# EAGLE design WZ8048C070-V1.1-20230407 (EAGLE 9.5.1)
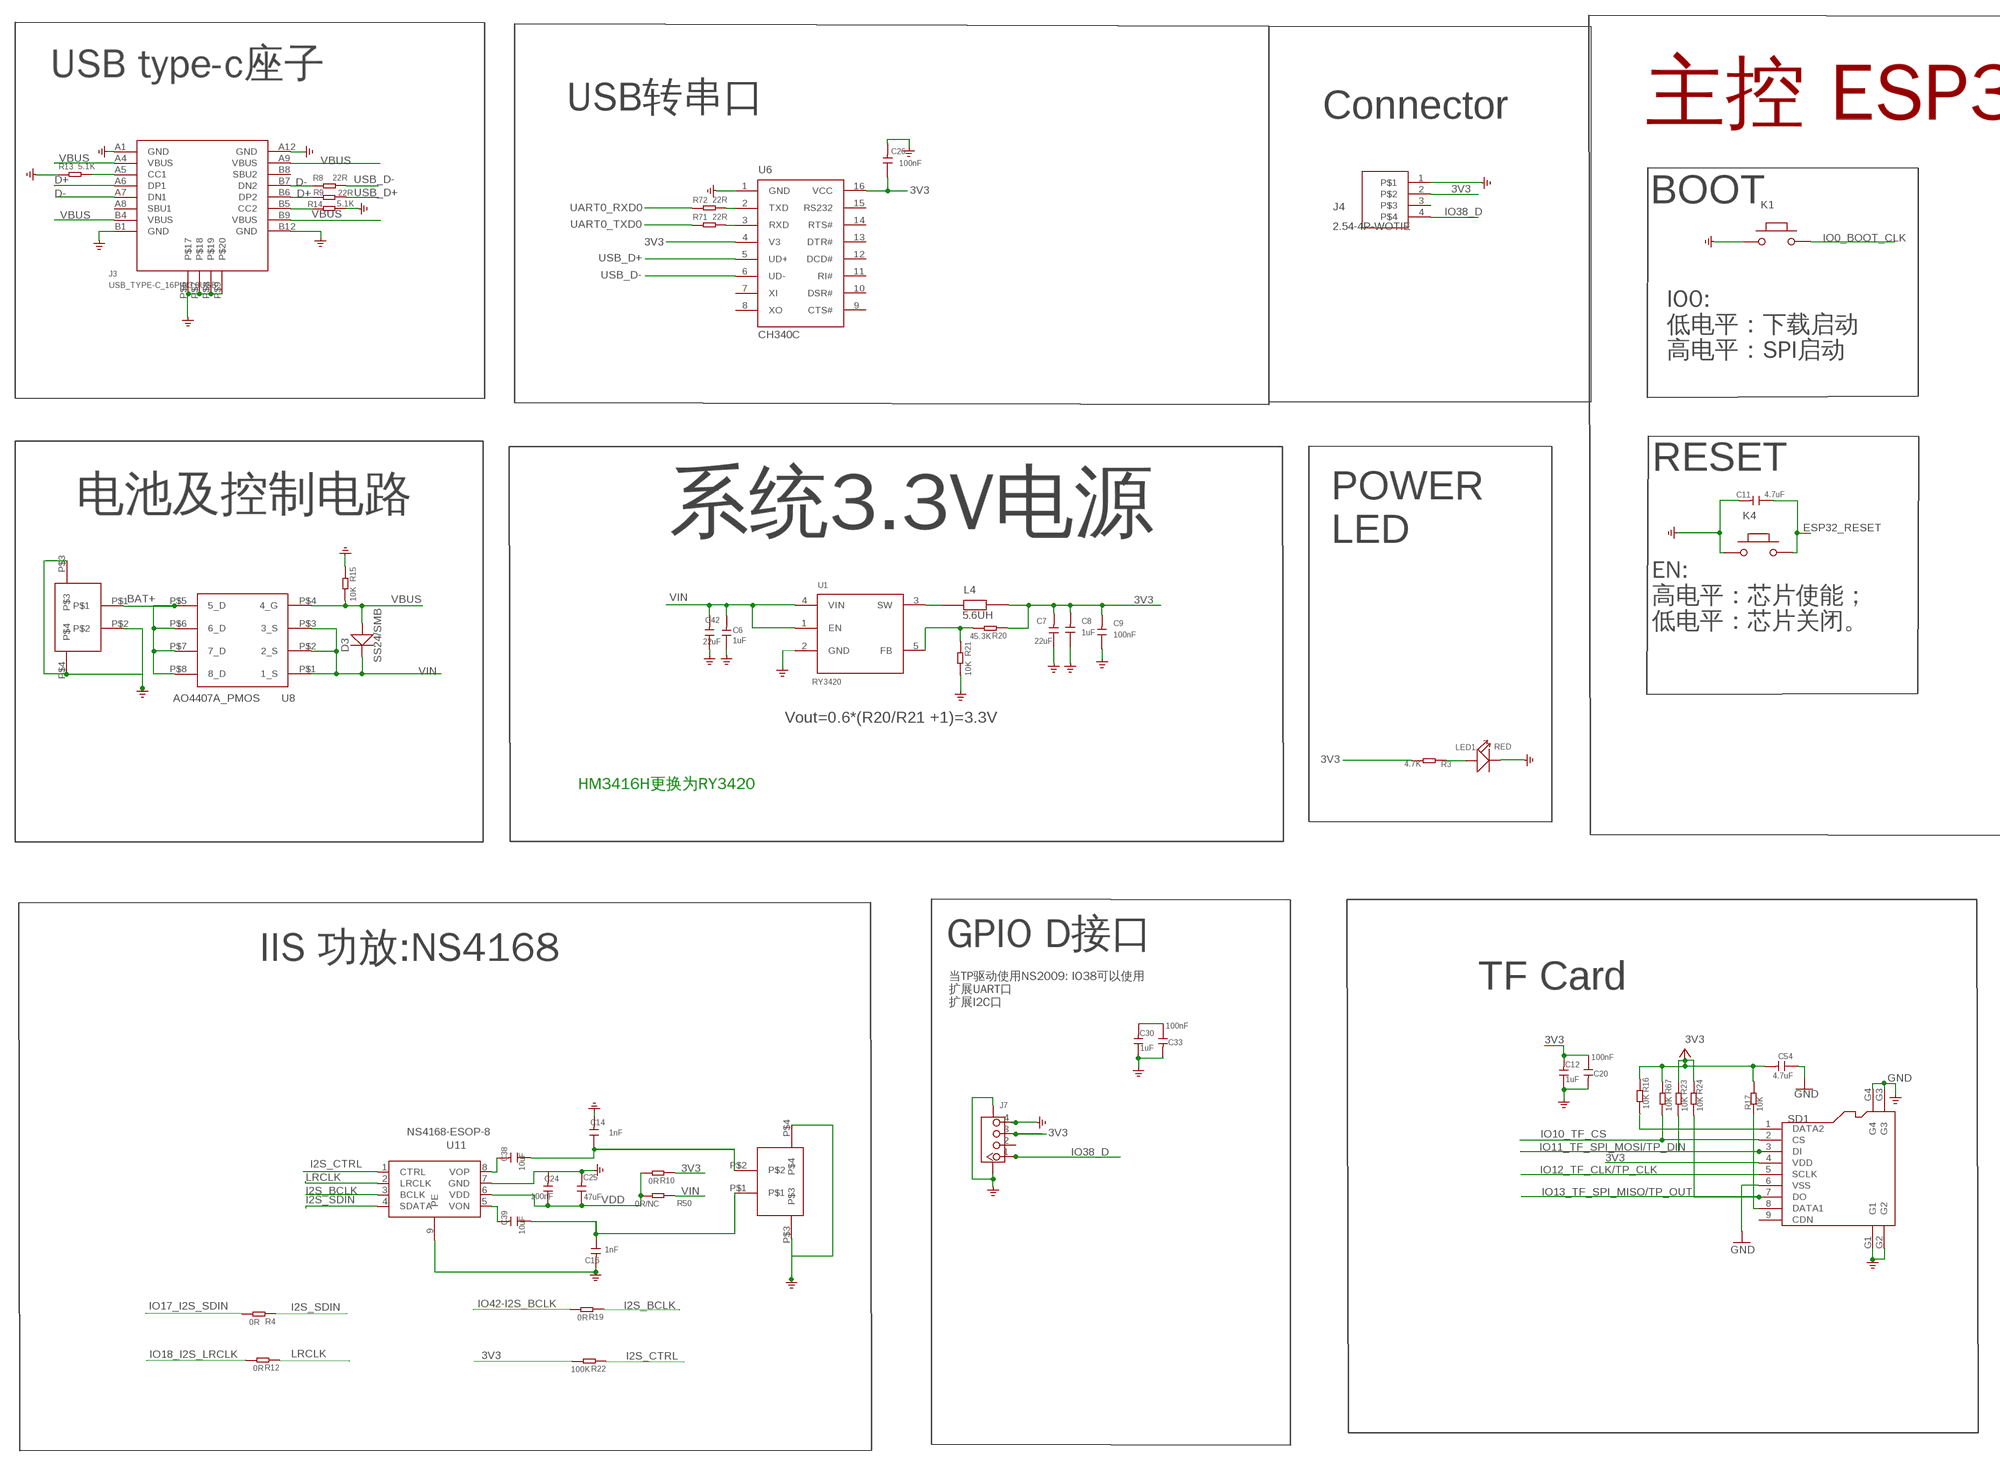
[diagram p0: schematic, sheet 1, part 1 of 2]
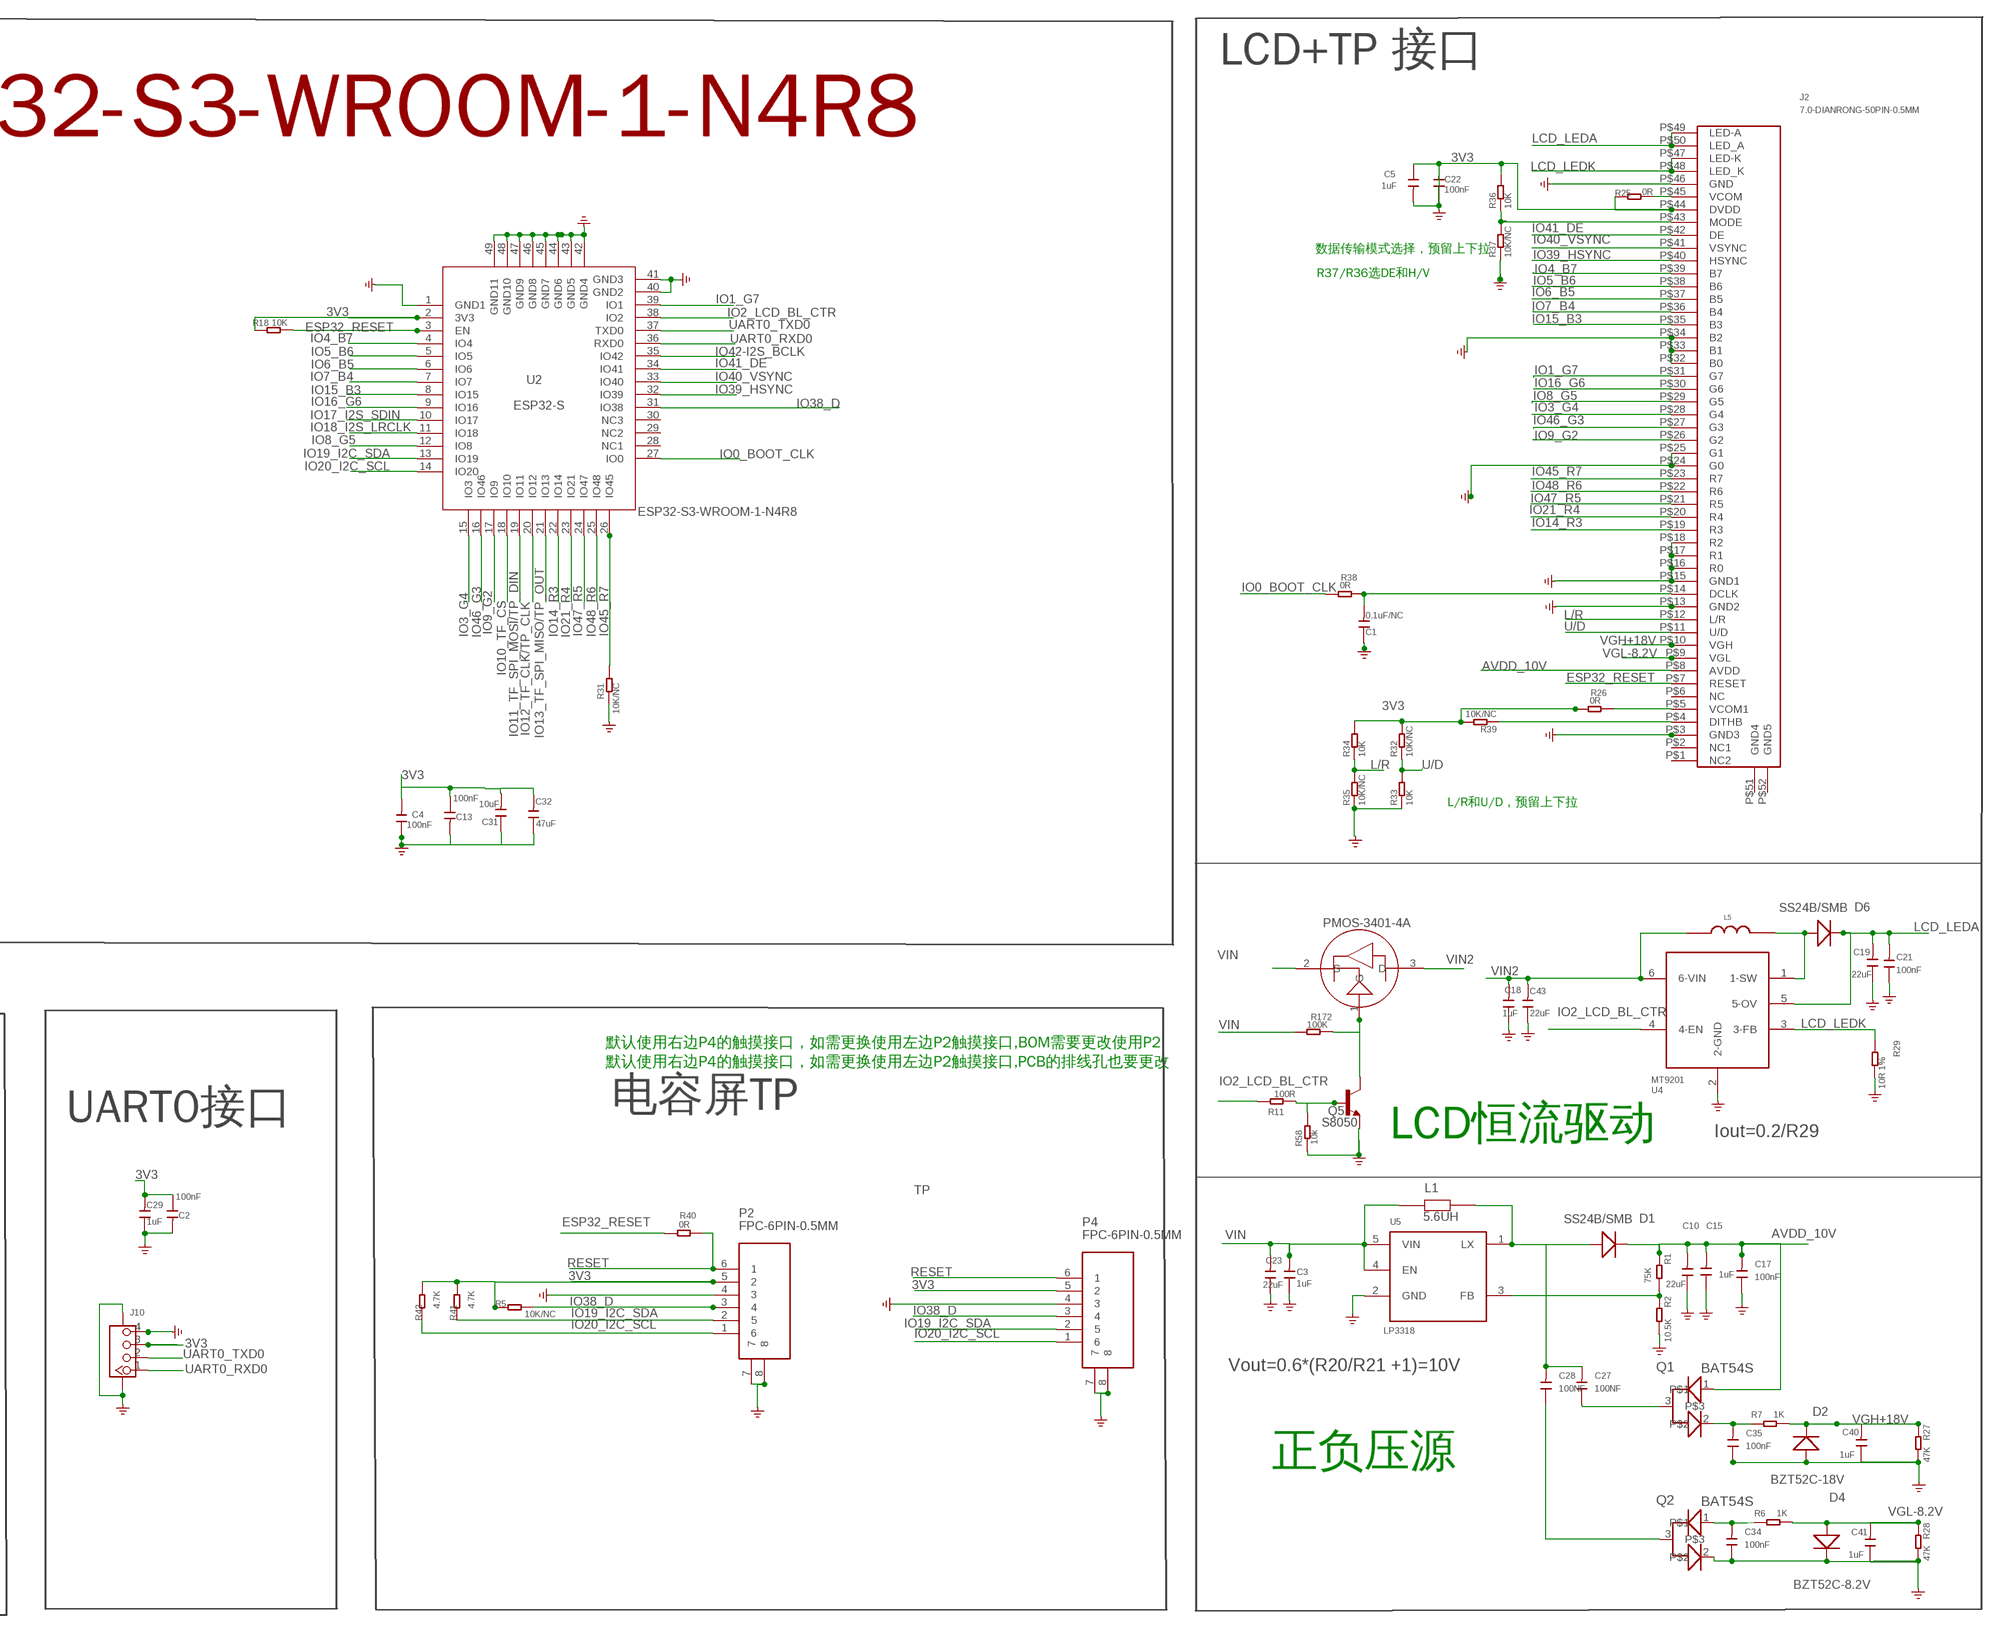
[diagram p1: schematic, sheet 1, part 2 of 2]

## Parts
C1  0.1uF/NC  DISCRETE_C-0603  [DISCRETE_C0603]
C2  100nF  C-0603  [C0603]
C3  1uF  C0603  [0603]
C4  100nF  C-0603  [C0603]
C5  1uF  C-0603  [C0603]
C6  1uF  C0603  [0603]
C7  22uF  C0805  [0805]
C8  1uF  C0603  [0603]
C9  100nF  C0603  [0603]
C10  22uF  C0805  [0805]
C11  4.7uF  C0603  [0603]
C12  1uF  DISCRETE_C-0603  [DISCRETE_C0603]
C13  100nF  C-0603  [C0603]
C14  1nF  C-0603  [C0603]
C15  1uF  C0603  [0603]
C16  1nF  C-0603  [C0603]
C17  100nF  C0603  [0603]
C18  1uF  C0603  [0603]
C19  22uF  C0805  [0805]
C20  100nF  C-0603  [C0603]
C21  100nF  C0603  [0603]
C22  100nF  C-0603  [C0603]
C23  22uF  C0805  [0805]
C24  100nF  C-0603  [C0603]
C25  47uF  C0805  [0805]
C26  100nF  C0603  [0603]
C27  100NF  C0603  [0603]
C28  100NF  C0603  [0603]
C29  1uF  DISCRETE_C-0603  [DISCRETE_C0603]
C30  1uF  DISCRETE_C-0603  [DISCRETE_C0603]
C31  10uF  DISCRETE_C-0603  [DISCRETE_C0603]
C32  47uF  C0805  [0805]
C33  100nF  C-0603  [C0603]
C34  100nF  C0603  [0603]
C35  100nF  C0603  [0603]
C38  10uF  C-0603  [C0603]
C39  10uF  C-0603  [C0603]
C40  1uF  C0805  [0805]
C41  1uF  C0805  [0805]
C42  22uF  C0805  [0805]
C43  22uF  C0805  [0805]
C54  4.7uF  DISCRETE_C-0603  [DISCRETE_C0603]
D1  SS24B/SMB  214ABDO-214AB  [214AB]
D2  BZT52C-18V  DISCRETE_D1206  [DISCRETE_SOD123]
D3  SS24/SMB  214ABDO-214AB  [214AB]
D4  BZT52C-8.2V  DISCRETE_D1206  [DISCRETE_SOD123]
D6  SS24B/SMB  214ABDO-214AB  [214AB]
J1  PH2.0WT-2PIN  [PH2.0WT-2PIN]
J2  7.0-DIANRONG-50PIN-0.5MM  [7.0-DAINRONG-50PIN-0.5MM]
J3  USB_TYPE-C_16PIN3.0USB  [KEVIN_3.0TYPEC-SMD]
J4  2.54-4P-WOTIE  [2.54-4P-WOTIE]
J5  PH2.0WT-2PIN  [PH2.0WT-2PIN]
J7  CONNECTOR_TWIG-4P-2.0-SMD-FEMALE-REINFORCE90D  [CONNECTOR_4P-SMD-2.0-90D]
J10  CONNECTOR_TWIG-4P-2.0-SMD-FEMALE-REINFORCE90D  [CONNECTOR_4P-SMD-2.0-90D]
K1  BUTTON  PB157  [157SW]
K4  BUTTON  PB157  [157SW]
L1  5.6UH  CROWPI2-MB-V1.4-20211012_CMP201209UD1R0MT  [CD54]
L4  5.6UH  CROWPI2-MB-V1.4-20211012_CMP201209UD1R0MT  [CD54]
L5  CD32_6.8uH  CD32_950MA  [CD32]
LED1  RED  DISCRETE_LED0603  [DISCRETE_LED-0603]
P2  FPC-6PIN-0.5MM  [FPC-6PIN-0.5MM]
P4  FPC-6PIN-0.5MM  [FPC-6PIN-0.5MM]
Q1  BAT54S  [SOT23-3]
Q2  BAT54S  [SOT23-3]
Q5  S8050  SPARKFUN_TRANSISTOR_NPNSOT23  [SPARKFUN_SOT23]
Q30  PMOS-3401-4A  P-MOS-SOT23  [SOT-23]
R1  75K  DISCRETE_R-0603  [DISCRETE_R0603]
R2  10.5K  DISCRETE_R-0603  [DISCRETE_R0603]
R3  4.7K  DISCRETE_R-0603  [DISCRETE_R0603]
R4  0R  DISCRETE_R-0603  [DISCRETE_R0603]
R5  10K/NC  DISCRETE_R-0603  [DISCRETE_R0603]
R6  1K  DISCRETE_R-0603  [DISCRETE_R0603]
R7  1K  DISCRETE_R-0603  [DISCRETE_R0603]
R8  22R  DISCRETE_R-0603  [DISCRETE_R0603]
R9  22R  DISCRETE_R-0603  [DISCRETE_R0603]
R10  0R  DISCRETE_R-0603  [DISCRETE_R0603]
R11  100R  R0603  [R0603]
R12  0R  DISCRETE_R-0603  [DISCRETE_R0603]
R13  5.1K  DISCRETE_R-0603  [DISCRETE_R0603]
R14  5.1K  DISCRETE_R-0603  [DISCRETE_R0603]
R15  10K  DISCRETE_R-0603  [DISCRETE_R0603]
R16  10K  DISCRETE_R-0603  [DISCRETE_R0603]
R17  10K  DISCRETE_R-0603  [DISCRETE_R0603]
R18  10K  DISCRETE_R-0603  [DISCRETE_R0603]
R19  0R  DISCRETE_R-0603  [DISCRETE_R0603]
R20  45.3K  DISCRETE_R-0603  [DISCRETE_R0603]
R21  10K  DISCRETE_R-0603  [DISCRETE_R0603]
R22  100K  DISCRETE_R-0603  [DISCRETE_R0603]
R23  10K  DISCRETE_R-0603  [DISCRETE_R0603]
R24  10K  DISCRETE_R-0603  [DISCRETE_R0603]
R25  0R  DISCRETE_R-0603  [DISCRETE_R0603]
R26  0R  R-0603  [R0603]
R27  47K  DISCRETE_R-0603  [DISCRETE_R0603]
R28  47K  DISCRETE_R-0603  [DISCRETE_R0603]
R29  10R 1%  DISCRETE_R-0603  [DISCRETE_R0603]
R31  10K/NC  R0603  [R0603]
R32  10K/NC  DISCRETE_R-0603  [DISCRETE_R0603]
R33  10K  DISCRETE_R-0603  [DISCRETE_R0603]
R34  10K  DISCRETE_R-0603  [DISCRETE_R0603]
R35  10K/NC  DISCRETE_R-0603  [DISCRETE_R0603]
R36  10K  DISCRETE_R-0603  [DISCRETE_R0603]
R37  10K/NC  DISCRETE_R-0603  [DISCRETE_R0603]
R38  0R  R-0603  [R0603]
R39  10K/NC  DISCRETE_R-0603  [DISCRETE_R0603]
R40  0R  R-0603  [R0603]
R41  4.7K  DISCRETE_R-0603  [DISCRETE_R0603]
R42  4.7K  DISCRETE_R-0603  [DISCRETE_R0603]
R50  0R/NC  DISCRETE_R-0603  [DISCRETE_R0603]
R58  10k  R0603  [R0603]
R67  10K  DISCRETE_R-0603  [DISCRETE_R0603]
R71  22R  DISCRETE_R-0603  [DISCRETE_R0603]
R72  22R  DISCRETE_R-0603  [DISCRETE_R0603]
R172  100K  R-0603  [R0603]
SD1  HOLDER-MICROSD-9P  [9P-SMD-W/-RING]
U1  RY3420  A_XBJ_HM3420B  [A_XBJ_SOT23-5]
U2  ESP32-S  [ESP32-S3]
U4  MT9201  [SOT23-6]
U5  LP3318  [LP3318_SOT23-5]
U6  CH340C  CH340G  [SOP-16]
U8  AO4407A_PMOS  T_PMOS_AO4407A_SOP8  [SOP8]
U11  NS4168-ESOP-8  [NS4168-ESOP-8]

## Nets
3V3: C2.1 C4.2 C5.1 C7.2 C8.2 C9.2 C12.2 C13.1 C20.1 C22.2 C26.1 C29.2 C30.2 C31.2 C32.2 C33.1 C54.2 J2.P$44(DVDD) J4.2 J7.3 J10.3 L4.2 P2.5 P4.5 R3.2 R5.1 R10.1 R16.1 R17.1 R18.1 R20.1 R22.2 R23.1 R24.1 R25.1 R26.1 R32.2 R34.2 R36.2 R39.2 R41.2 R42.2 R67.1 SD1.4(VDD) U2.2(3V3) U6.4(V3) U6.16(VCC) ; supply symbol labelled +3V3
AVDD_10V: C10.2 C15.2 C17.2 D1.2(-) J2.P$8(AVDD) Q1.1 R1.1
BAT+: J1.P$1 U8.P$5(5_D) U8.P$6(6_D) U8.P$7(7_D) U8.P$8(8_D)
D+: J3.A6(DP1) J3.B6(DP2) R9.1
D-: J3.A7(DN1) J3.B7(DN2) R8.1
DCLK1: C1.2 J2.P$14(DCLK) R38.2
ESP32_RESET: C11.1 J2.P$7(RESET) K4.2 R18.2 R40.1 U2.3(EN)
GND: C1.1 C2.2 C3.1 C4.1 C5.2 C6.1 C7.1 C8.1 C9.1 C10.1 C11.2 C12.1 C13.2 C14.2 C15.1 C16.2 C17.1 C18.1 C19.1 C20.2 C21.1 C22.1 C23.1 C24.2 C25.2 C26.2 C29.1 C30.1 C31.1 C32.1 C33.2 C34.1 C35.1 C40.1 C41.1 C42.1 C43.1 C54.1 D2.+ D4.- J1.P$2 J1.P$3 J1.P$4 J2.P$3(GND3) J2.P$13(GND2) J2.P$15(GND1) J2.P$16(R0) J2.P$17(R1) J2.P$18(R2) J2.P$24(G0) J2.P$25(G1) J2.P$32(B0) J2.P$33(B1) J2.P$34(B2) J2.P$46(GND) J3.A1(GND) J3.A12(GND) J3.B1(GND) J3.B12(GND) J3.P$6 J3.P$7 J3.P$8 J3.P$9 J4.1 J5.P$3 J5.P$4 J7.4 J7.SS1 J7.SS2 J10.4 J10.SS1 J10.SS2 K1.1 K4.1 LED1.- P2.4 P2.7 P2.8 P4.4 P4.7 P4.8 Q2.2 Q5.2(E) R2.2 R13.1 R14.2 R15.1 R21.2 R27.2 R28.2 R29.2 R31.1 R33.1 R35.1 R37.1 R58.1 SD1.6(VSS) SD1.G1 SD1.G2 SD1.G3 SD1.G4 U1.2(GND) U2.1(GND1) U2.40(GND2) U2.41(GND3) U2.42(GND4) U2.43(GND5) U2.44(GND6) U2.45(GND7) U2.46(GND8) U2.47(GND9) U2.48(GND10) U2.49(GND11) U4.2(2-GND) U5.2(GND) U6.1(GND) U11.7(GND) U11.9(PE)
I2S_BCLK: R19.1 U11.3(BCLK)
I2S_CTRL: R22.1 U11.1(CTRL)
I2S_SDIN: R4.1 U11.4(SDATA)
IO0_BOOT_CLK: K1.2 R38.1 U2.27(IO0)
IO1_G7: J2.P$31(G7) U2.39(IO1)
IO2_LCD_BL_CTR: R11.2 U2.38(IO2) U4.4(4-EN)
IO3_G4: J2.P$28(G4) U2.15(IO3)
IO4_B7: J2.P$39(B7) U2.4(IO4)
IO5_B6: J2.P$38(B6) U2.5(IO5)
IO6_B5: J2.P$37(B5) U2.6(IO6)
IO7_B4: J2.P$36(B4) U2.7(IO7)
IO8_G5: J2.P$29(G5) U2.12(IO8)
IO9_G2: J2.P$26(G2) U2.17(IO9)
IO10_TF_CS: R67.2 SD1.2(CS) U2.18(IO10)
IO11_TF_SPI_MOSI/TP_DIN: R23.2 SD1.3(DI) U2.19(IO11)
IO12_TF_CLK/TP_CLK: SD1.5(SCLK) U2.20(IO12)
IO13_TF_SPI_MISO/TP_OUT: R24.2 SD1.7(DO) U2.21(IO13)
IO14_R3: J2.P$19(R3) U2.22(IO14)
IO15_B3: J2.P$35(B3) U2.8(IO15)
IO16_G6: J2.P$30(G6) U2.9(IO16)
IO17_I2S_SDIN: R4.2 U2.10(IO17)
IO18_I2S_LRCLK: R12.2 U2.11(IO18)
IO19_I2C_SDA: P2.2 P4.2 R41.1 U2.13(IO19)
IO20_I2C_SCL: P2.1 P4.1 R42.1 U2.14(IO20)
IO21_R4: J2.P$20(R4) U2.23(IO21)
IO38_D: J4.4 J7.1 P2.3 P4.3 R5.2 U2.31(IO38)
IO39_HSYNC: J2.P$40(HSYNC) U2.32(IO39)
IO40_VSYNC: J2.P$41(VSYNC) U2.33(IO40)
IO41_DE: J2.P$42(DE) U2.34(IO41)
IO42-I2S_BCLK: R19.2 U2.35(IO42)
IO45_R7: J2.P$23(R7) R31.2 U2.26(IO45)
IO46_G3: J2.P$27(G3) U2.16(IO46)
IO47_R5: J2.P$21(R5) U2.24(IO47)
IO48_R6: J2.P$22(R6) U2.25(IO48)
L/R: J2.P$12(L/R) R34.1 R35.2
LCD_LEDA: C19.2 C21.2 D6.2(-) J2.P$49(LED-A) J2.P$50(LED_A) U4.5(5-OV)
LCD_LEDK: J2.P$47(LED-K) J2.P$48(LED_K) R29.1 U4.3(3-FB)
LRCLK: R12.1 U11.2(LRCLK)
N$1: LED1.+ R3.1
N$2: J2.P$45(VCOM) R25.2
N$3: C14.1 C38.1 J5.P$2
N$4: J2.P$5(VCOM1) R26.2
N$6: C38.2 U11.8(VOP)
N$7: R1.2 R2.1 U5.3(FB)
N$8: C39.2 U11.5(VON)
N$9: C27.2 C28.2 D1.1(+) L1.2 U5.1(LX)
N$10: C27.1 Q1.3
N$11: J3.A5(CC1) R13.2
N$12: J2.P$43(MODE) R36.1 R37.2
N$13: L4.1 U1.3(SW)
N$14: J2.P$4(DITHB) R39.1
N$15: C16.1 C39.1 J5.P$1
N$16: D6.1(+) L5.2 U4.1(1-SW)
N$17: J3.B5(CC2) R14.1
N$20: R20.2 R21.1 U1.5(FB)
N$23: Q5.1(B) R11.1 R58.2
N$24: C28.1 Q2.3
N$29: C35.2 Q1.2 R7.1
N$30: C34.2 Q2.1 R6.1
N$36: Q5.3(C) Q30.1(G) R172.2
N$40: R72.2 U6.2(TXD)
N$42: R71.2 U6.3(RXD)
N$47: R16.2 SD1.1(DATA2)
N$48: R17.2 SD1.8(DATA1)
RESET: P2.6 P4.6 R40.2
U/D: J2.P$11(U/D) R32.1 R33.2
UART0_RXD0: J10.1 R72.1 U2.36(RXD0)
UART0_TXD0: J10.2 R71.1 U2.37(TXD0)
USB_D+: R9.2 U6.5(UD+)
USB_D-: R8.2 U6.6(UD-)
VBUS: D3.1(+) J3.A4(VBUS) J3.A9(VBUS) J3.B4(VBUS) J3.B9(VBUS) R15.2 U8.P$4(4_G)
VDD: C24.1 C25.1 R10.2 R50.2 U11.6(VDD)
VGH+18V: C40.2 D2.- J2.P$10(VGH) R7.2 R27.1
VGL-8.2V: C41.2 D4.+ J2.P$9(VGL) R6.2 R28.1
VIN: C3.2 C6.2 C23.2 C42.2 D3.2(-) L1.1 Q30.2(S) R50.1 R172.1 U1.1(EN) U1.4(VIN) U5.4(EN) U5.5(VIN) U8.P$1(1_S) U8.P$2(2_S) U8.P$3(3_S)
VIN2: C18.2 C43.2 L5.1 Q30.3(D) U4.6(6-VIN)
Unconnected: J2.P$1(NC2) J2.P$2(NC1) J2.P$6(NC) J2.P$51(GND4) J2.P$52(GND5) J3.A8(SBU1) J3.B8(SBU2) J4.3 J7.2 SD1.9(CDN) U2.28(NC1) U2.29(NC2) U2.30(NC3) U6.7(XI) U6.8(XO) U6.9(CTS#) U6.10(DSR#) U6.11(RI#) U6.12(DCD#) U6.13(DTR#) U6.14(RTS#) U6.15(RS232)

## Notes on the sheet
- LCD+TP 接口
- USB type-c座子
- USB转串口 | Connector | 主控 ESP32-S3-WROOM-1-N4R8
- BOOT
- 数据传输模式选择，预留上下拉
- R37/R36选DE和H/V
- IO0:
  低电平：下载启动
  高电平：SPI启动
- RESET
- 电池及控制电路
- 系统3.3V电源
- POWER
  LED
- EN:
  高电平：芯片使能；
  低电平：芯片关闭。
- L/R和U/D，预留上下拉
- Vout=0.6*(R20/R21 +1)=3.3V
- HM3416H更换为RY3420
- 默认使用右边P4的触摸接口，如需更换使用左边P2触摸接口,BOM需要更改使用P2
- GPIO D接口 | 默认使用右边P4的触摸接口，如需更换使用左边P2触摸接口,PCB的排线孔也要更改
- IIS 功放:NS4168
- TF Card | UART0接口 | 电容屏TP
- 当TP驱动使用NS2009: IO38可以使用
  扩展UART口
  扩展I2C口
- LCD恒流驱动 | Iout=0.2/R29
- TP
- Vout=0.6*(R20/R21 +1)=10V
- 正负压源

## Library data of the parts
C1 C31 C54 = A9G:DISCRETE_C*: Ceramic Capacitors
C2 C4 C5 C13 C14 C16 C20 C22 C24 C33 C38 C39 = discrete:C*: Ceramic Capacitors
C3 C6 C8 C9 C11 C15 C17 C18 C21 C26-C28 C34 C35 = A_xbj:C0603
C7 C10 C19 C23 C25 C32 C40-C43 = A_xbj:C0805
C12 C29 C30 = A_xbj:DISCRETE_C*: Ceramic Capacitors
D1 D3 D6 = DO-214AB:214AB: 214AB
D2 D4 = cooper:DISCRETE_D*
J1 J5 = cooper:PH2.0WT-2PIN
J2 = cooper:7.0-DIANRONG-50PIN-0.5MM
J3 = WZ3532R024-ESP32-V0.1-20221226:USB_TYPE-C_16PIN
J4 = cooper:2.54-4P-WOTIE
J7 J10 = A_xbj:CONNECTOR_TWIG-4P-2.0-SMD-FEMALE-REINFORCE
K1 K4 = MySMD:PB157
L1 L4 = CD54:CROWPI2-MB-V1.4-20211012_CMP201209UD1R0MT
L5 = CD54:CD32_950MA
LED1 = A_xbj:DISCRETE_LED*
P2 P4 = cooper:FPC-6PIN-0.5MM
Q1 Q2 = cooper:BAT54S
Q5 = Adafruit_HUZZAH32_ESP32_Feather:SPARKFUN_TRANSISTOR_NPN: Transistor NPN BJT configuration in SOT23 package. MMBT2222 is the common NPN we use. Double check BCE configuration again layout.
Q30 = DFN8:P-MOS-SOT23
R1-R10 R12-R25 R27-R29 R41 R42 R50 R67 R71 R72 = Crowtail-_LED-V2.0-20190615-01:DISCRETE_R*
R11 R31 R58 = cooper:R0603
R26 R38 R40 R172 = discrete:R*
R32-R37 R39 = A9G:DISCRETE_R*
SD1 = Connector:HOLDER-MICROSD-9P
U1 = CrowBot_-V1.0-20220525:A_XBJ_HM3420B
U2 = DW1000:ESP32-S; U2: ESP32-S3-WROOM-1-N4R8
U4 = cooper:MT9201
U5 = cooper:LP3318
U6 = A_xbj:CH340G
U8 = cooper:T_PMOS_AO4407A_SOP8
U11 = STC_MCUSTC8G1K08A:NS4168-ESOP-8

## Net classes
0 default: width 0.152 mm, drill 0.152 mm, clearance 0.152 mm

## Board
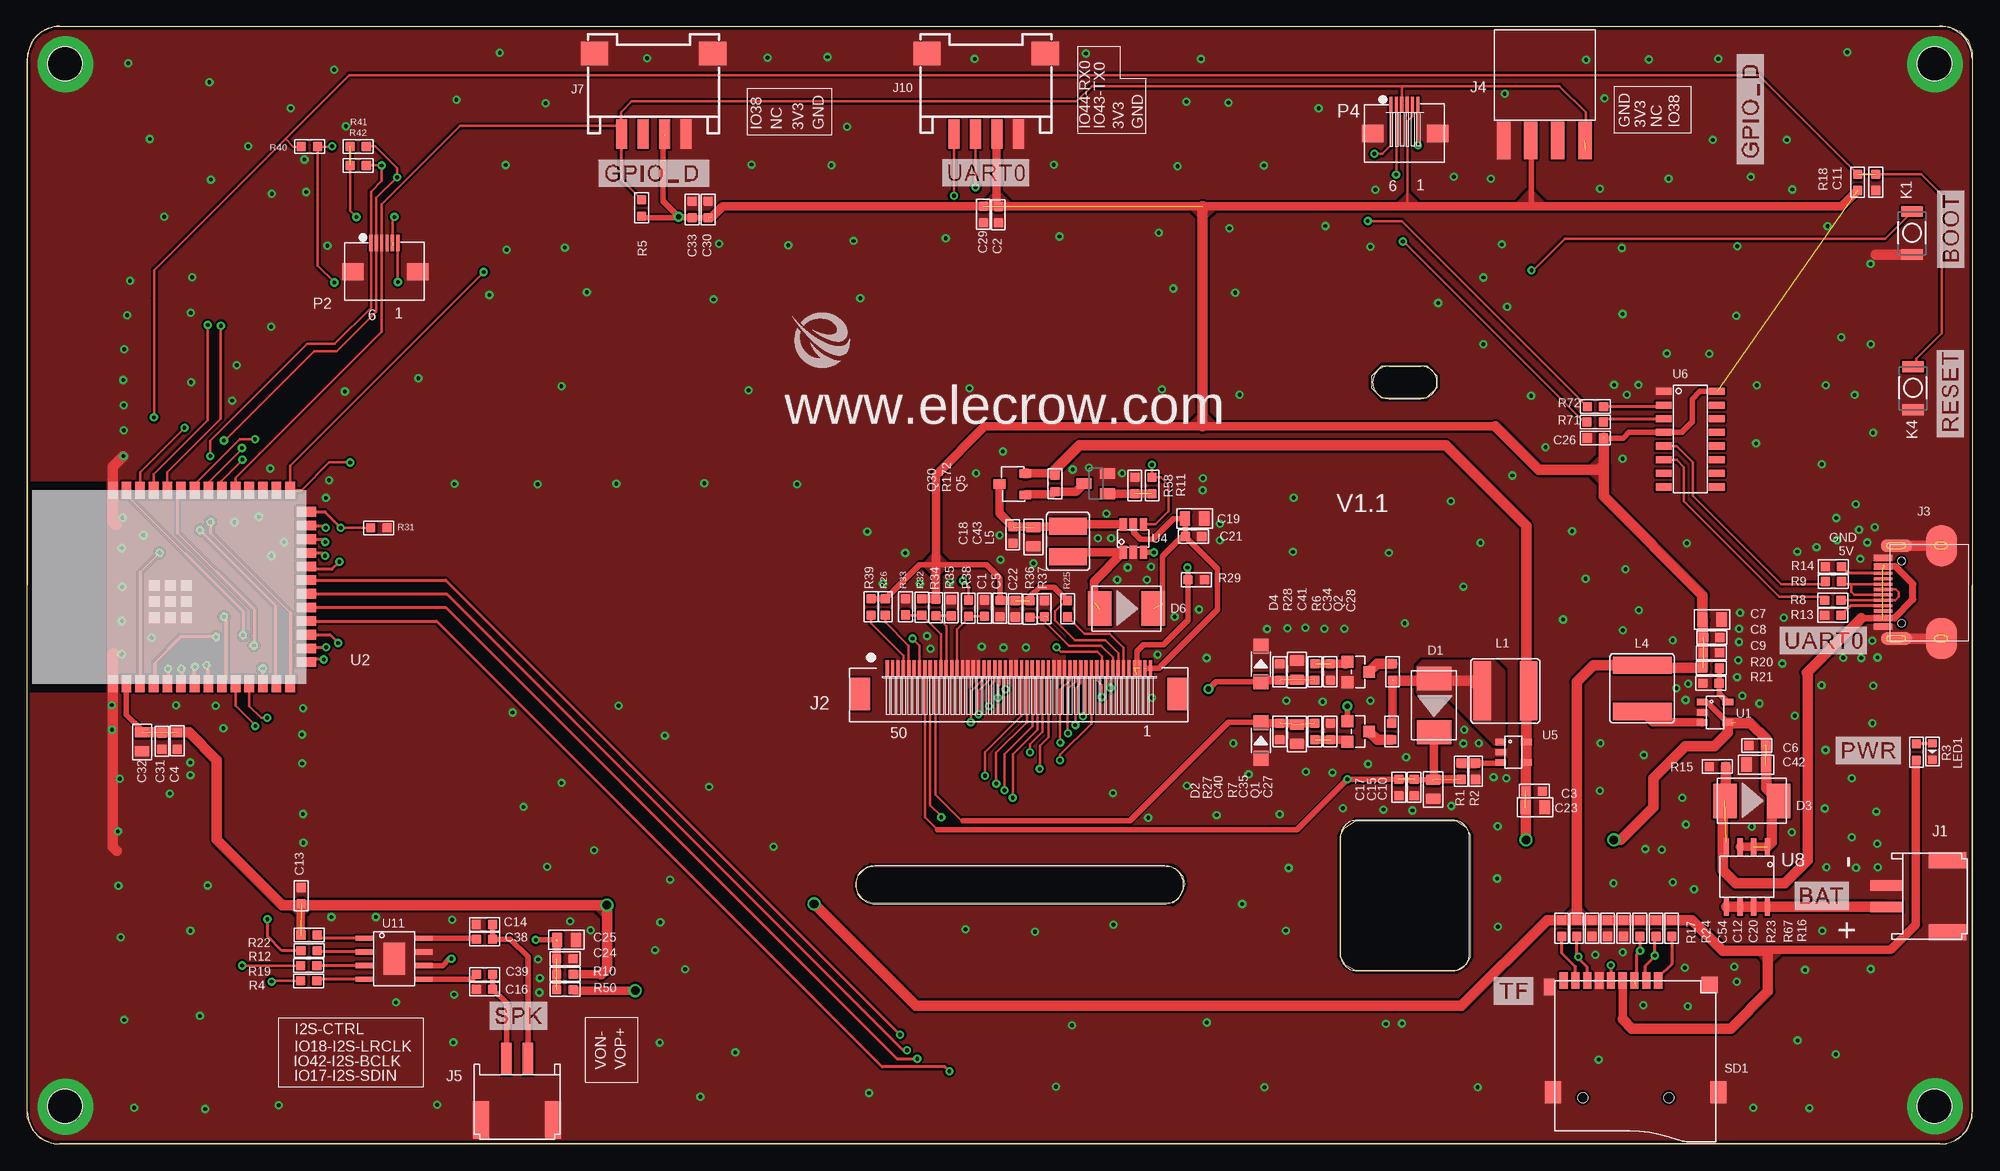
[diagram p2: board, top side]
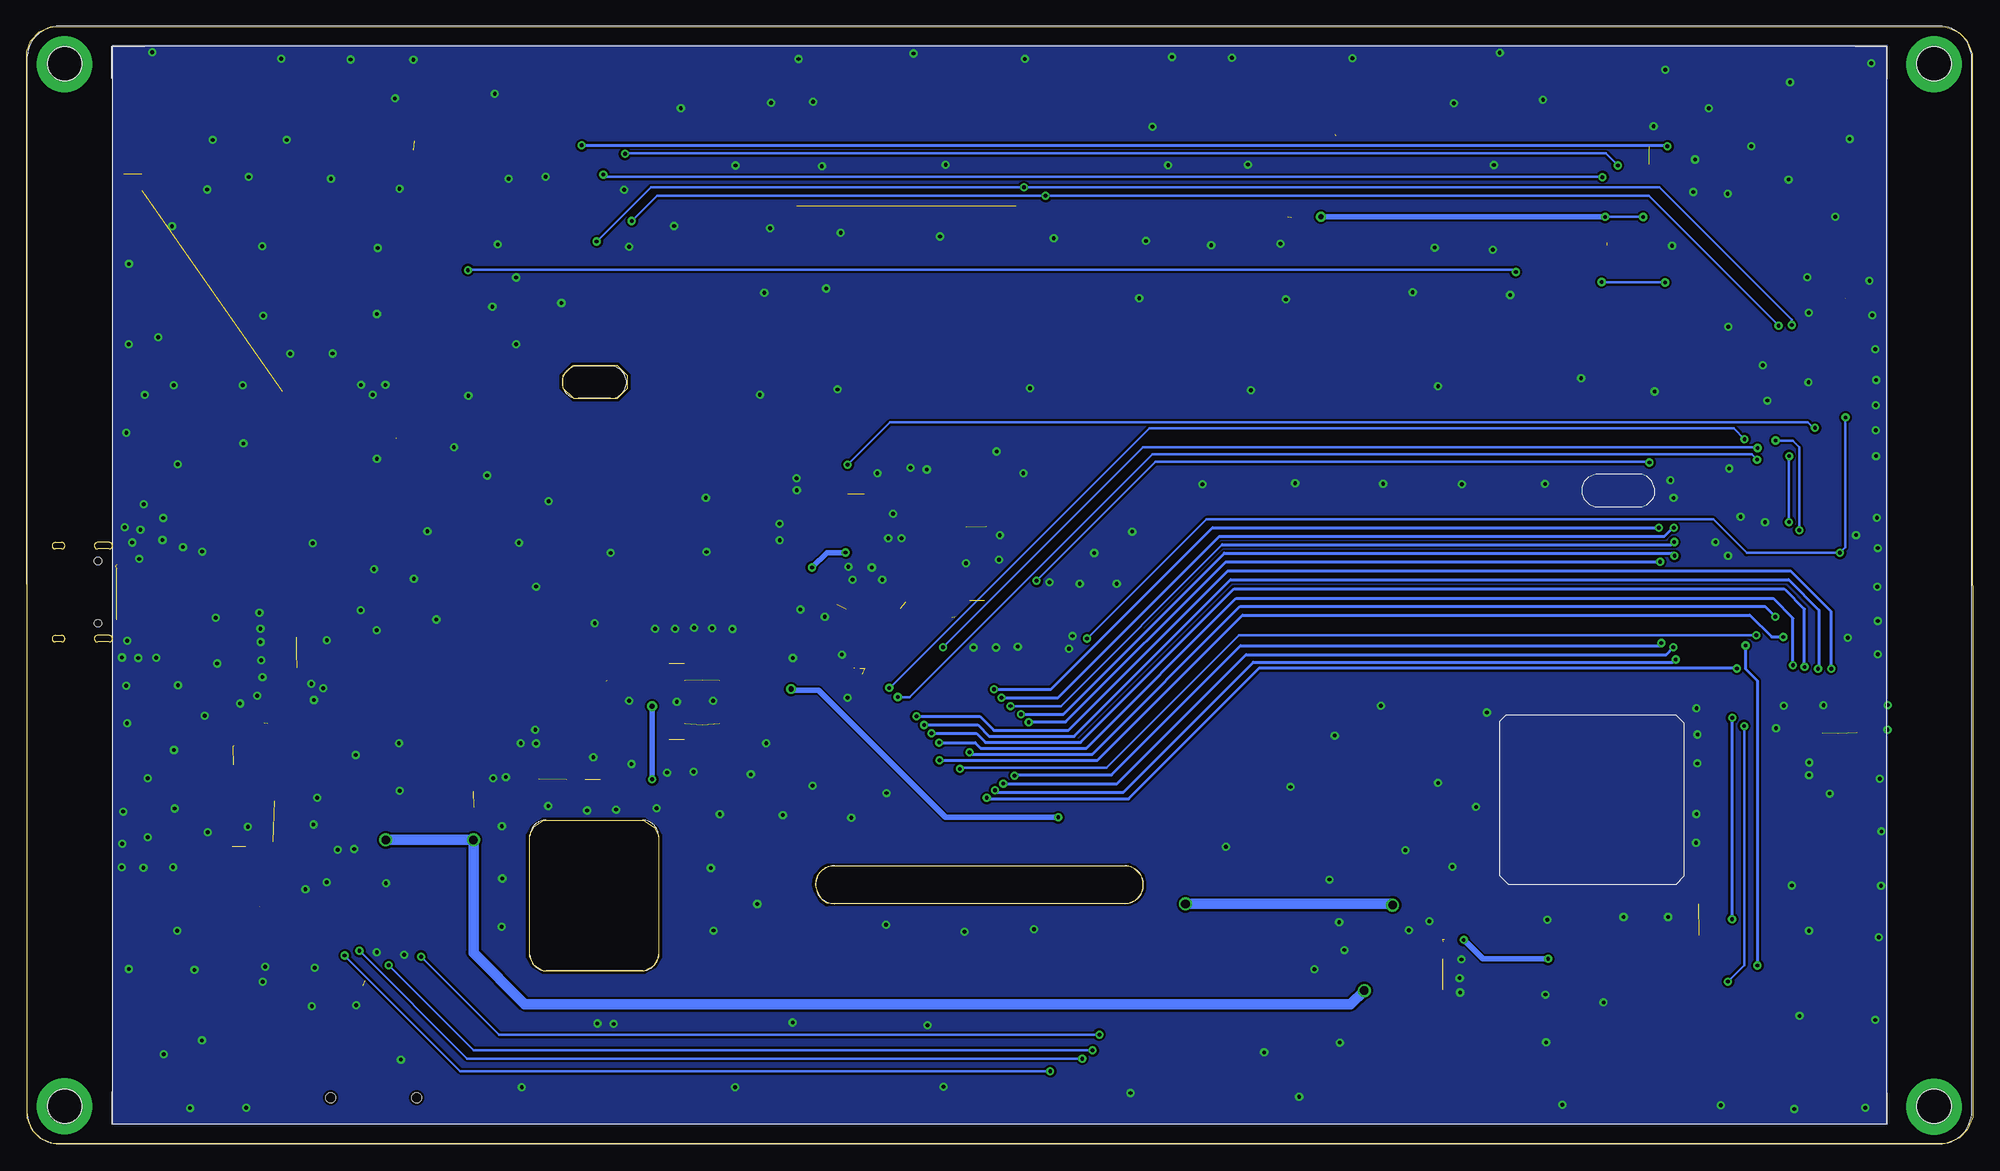
[diagram p3: board, bottom side, seen from below]

Size 181.1 x 103.94 mm. Coordinates in mm from the lower left corner, seen from the top.
Outline: 106.62,22.39 78.53,22.41 77.85,22.73 77.78,22.82 77.43,23.28 77.32,23.44 77.22,23.8 77.22,24.4 77.35,24.93 78.03,25.61 78.54,25.82 106.55,25.79 106.87,25.63 107.12,25.43 107.54,24.96 107.7,24.5 107.75,24.11 107.57,23.51 107.13,22.78 106.62,22.39
Outline: 178.83,103.94 2.42,103.91 1.28,103.44 0.54,102.7 0.03,101.45 0,2.48 0.48,1.32 1.26,0.54 2.57,0 178.63,0 179.81,0.49 180.61,1.29 181.08,2.41 181.1,101.63 180.75,102.66 179.93,103.48 178.83,103.94
Outline: 125.18,70.29 125.18,71.46 126.1,72.39 130.3,72.39 131.22,71.46 131.22,70.37 130.22,69.36 126.1,69.36 125.18,70.29
Outline: 133.07,16.11 123.66,16.11 122.71,16.62 122.24,17.4 122.24,28.65 122.64,29.39 123.66,30.05 133.07,30.05 133.93,29.48 134.33,28.73 134.33,17.43 133.93,16.68 133.07,16.11
Copper layers (1*16): Top 0.035mm / dielectric 1.5mm / Bottom 0.035mm
Design rules "default *": minimum track width 10mil, minimum drill 0.35mm, track to track 8mil, track to pad 7mil, pad to pad 7mil, via to via 8mil, smd to smd 10mil, copper to edge 10mil, drill to drill 8mil, minimum pad ring 10mil, minimum via ring 8mil, stop-mask expansion 4mil, vias tented up to drill 100mil, thermal gap 0mil

### Footprints (pad centres in the part's own frame; a part is rotated, then mirrored left to right if it is on the bottom)
DISCRETE_C0603 = smd 0.889 x 0.889: 1 -0.762,0; 2 0.762,0
C0603 = smd 0.889 x 0.889: 1 -0.762,0; 2 0.762,0
0603 = smd 0.889 x 0.889: 1 -0.762,0; 2 0.762,0
0805 = smd 1.016 x 1.397: 1 -0.889,0; 2 0.889,0
214AB = smd 2.2 x 3.2: 1 -2.5,0; 2 2.5,0
DISCRETE_SOD123 = smd 1.397 x 1.397: + -1.651,0; - 1.651,0
PH2.0WT-2PIN = smd 1 x 3: P$1 -1,0; P$2 1,0 | smd 1.5 x 3.5: P$3 -3.35,-5.7; P$4 3.35,-5.7
7.0-DAINRONG-50PIN-0.5MM = smd 0.3 x 1.5: P$1 -10.08,1.73; P$2 -9.58,1.73; P$3 -9.08,1.73; P$4 -8.58,1.73; P$5 -8.08,1.73; P$6 -7.58,1.73; P$7 -7.08,1.73; P$8 -6.58,1.73; P$9 -6.08,1.73; P$10 -5.58,1.73; P$11 -5.08,1.73; P$12 -4.58,1.73; P$13 -4.08,1.73; P$14 -3.58,1.73; P$15 -3.08,1.73; P$16 -2.58,1.73; P$17 -2.08,1.73; P$18 -1.58,1.73; P$19 -1.08,1.73; P$20 -0.58,1.73; P$21 -0.08,1.73; P$22 0.42,1.73; P$23 0.92,1.73; P$24 1.42,1.73; P$25 1.92,1.73; P$26 2.42,1.73; P$27 2.92,1.73; P$28 3.42,1.73; P$29 3.92,1.73; P$30 4.42,1.73; P$31 4.92,1.73; P$32 5.42,1.73; P$33 5.92,1.73; P$34 6.42,1.73; P$35 6.92,1.73; P$36 7.42,1.73; P$37 7.92,1.73; P$38 8.42,1.73; P$39 8.92,1.73; P$40 9.42,1.73; P$41 9.92,1.73; P$42 10.42,1.73; P$43 10.92,1.73; P$44 11.42,1.73; P$45 11.92,1.73; P$46 12.42,1.73; P$47 12.92,1.73; P$48 13.42,1.73; P$49 13.92,1.73; P$50 14.42,1.73 | smd 1.8 x 3: P$51 -12.58,-0.67; P$52 16.92,-0.67
KEVIN_3.0TYPEC-SMD = smd 0.3 x 1.7: A1 -3.35,0.5; A4 -2.55,0.5; A5 -1.25,0.5; A6 -0.25,0.5; A7 0.25,0.5; A8 1.25,0.5; A9 2.55,0.5; A12 3.35,0.5; B1 3.05,0.5; B4 2.25,0.5; B5 1.75,0.5; B6 0.75,0.5; B7 -0.75,0.5; B8 -1.75,0.5; B9 -2.25,0.5; B12 -3.05,0.5 | smd 1.143 x 2.921: P$6 -4.318,-0.762; P$7 4.318,-0.762 | smd 3.81 x 2.921: P$8 -4.318,-4.953; P$9 4.318,-4.953 | hole 0.68: -2.89,-1.22; 2.89,-1.22
2.54-4P-WOTIE = smd 1.25 x 3.5: 1 -3.759,-4.572; 2 -1.27,-4.572; 3 1.27,-4.572; 4 3.81,-4.572
CONNECTOR_4P-SMD-2.0-90D = smd 1.01 x 2.74: 1 -3,-0.1; 2 -1,-0.1; 3 1,-0.1; 4 3,-0.1 | smd 2.54 x 2.184: SS1 -5.5,7.4; SS2 5.5,7.4
157SW = smd 1.016 x 1.981: 1 0,0; 2 4,0
CD54 = smd 5.5 x 1.6: 1 0,2.159; 2 0,-2.159
CD32 = smd 3.5 x 1.6: 1 0,1.409; 2 0,-1.409
DISCRETE_LED-0603 = smd 0.762 x 0.889: + -0.762,0; - 0.762,0
FPC-6PIN-0.5MM = smd 0.3 x 1.5: 1 -1.31,2.184; 2 -0.81,2.184; 3 -0.31,2.184; 4 0.19,2.184; 5 0.69,2.184; 6 1.19,2.184 | smd 2 x 1.6: 7 -3.01,-0.496; 8 3.036,-0.496
SOT23-3 = smd 1.1 x 1.1: 1 -0.95,-1.016; 2 0.95,-1.016; 3 0,1.016
SPARKFUN_SOT23 = smd 1 x 1.4: 1 -0.95,-1.1; 2 0.95,-1.1; 3 0,1.1
SOT-23 = smd 1.1 x 0.8: 1 1.2,-1; 2 1.2,1 | smd 1.1 x 0.9: 3 -1.2,0
DISCRETE_R0603 = smd 0.889 x 0.889: 1 -0.762,0; 2 0.762,0
R0603 = smd 0.889 x 0.889: 1 -0.762,0; 2 0.762,0
9P-SMD-W/-RING = smd 1.524 x 0.762: 1 0,4.4; 2 0,3.3; 3 0,2.2; 4 0,1.1; 5 0,0; 6 0,-1.1; 7 0,-2.2; 8 0,-3.3; 9 0,-4.4 | smd 1.524 x 1.016: G1 0.6,-5.746 | smd 2.032 x 1.524: G2 10.373,-5.4; G3 10.373,10 | smd 1.524 x 1.524: G4 0.392,9.181 | hole 0.889: 10.9,-2.6; 10.9,5.4
A_XBJ_SOT23-5 = smd 0.6 x 1: 1 -0.95,-1.2; 2 0,-1.2; 3 0.95,-1.2; 4 0.95,1.2; 5 -0.95,1.2
ESP32-S3 = smd 1.6 x 0.9: 1 0,18.01; 2 0,16.74; 3 0,15.47; 4 0,14.2; 5 0,12.93; 6 0,11.66; 7 0,10.39; 8 0,9.12; 9 0,7.85; 10 0,6.58; 11 0,5.31; 12 0,4.04; 13 0,2.77; 14 0,1.5; 27 18,1.5; 28 18,2.77; 29 18,4.04; 30 18,5.31; 31 18,6.58; 32 18,7.85; 33 18,9.12; 34 18,10.39; 35 18,11.66; 36 18,12.93; 37 18,14.2; 38 18,15.47; 39 18,16.74; 40 18,18.01 | smd 0.9 x 1.8: 15 2,0; 16 3.28,0; 17 4.55,0; 18 5.82,0; 19 7.09,0; 20 8.36,0; 21 9.63,0; 22 10.9,0; 23 12.17,0; 24 13.44,0; 25 14.71,0; 26 16,0 | smd 1 x 1: 41 7.64,11.16; 42 9.14,11.16; 43 6.14,11.16; 44 6.14,14.16; 45 7.64,12.66; 46 9.14,12.66; 47 7.64,14.16; 48 9.14,14.16; 49 6.14,12.66
SOT23-6 = smd 0.69 x 1.2: 1 -0.95,-1.3; 2 0,-1.3; 3 0.95,-1.3; 4 0.95,1.3; 5 0,1.3; 6 -0.95,1.3
LP3318_SOT23-5 = smd 0.6 x 1: 1 -0.95,-1.2; 2 0,-1.2; 3 0.95,-1.2; 4 0.95,1.2; 5 -0.95,1.2
SOP-16 = smd 0.66 x 1.5: 1 -4.445,-2.475; 2 -3.175,-2.475; 3 -1.905,-2.475; 4 -0.635,-2.475; 5 0.635,-2.475; 6 1.905,-2.475; 7 3.175,-2.475; 8 4.445,-2.475; 9 4.445,2.475; 10 3.175,2.475; 11 1.905,2.475; 12 0.635,2.475; 13 -0.635,2.475; 14 -1.905,2.475; 15 -3.175,2.475; 16 -4.445,2.475
SOP8 = smd 0.5 x 1.6: P$1 -1.905,-2.8; P$2 -0.635,-2.8; P$3 0.635,-2.8; P$4 1.905,-2.8; P$5 1.905,2.8; P$6 0.635,2.8; P$7 -0.635,2.8; P$8 -1.905,2.8
NS4168-ESOP-8 = smd 1.6 x 0.5: 1 -2.8,1.905; 2 -2.8,0.635; 3 -2.8,-0.635; 4 -2.8,-1.905; 5 2.8,-1.905; 6 2.8,-0.635; 7 2.8,0.635; 8 2.8,1.905 | smd 2 x 3: 9 0,0

### Placement (x,y rotation side)
C1  89.13,49.84 270 top
C2  90.42,86.46 270 top
C3  140.3,32.82 180 top
C4  14,37.49 90 top
C5  90.56,49.82 270 top
C6  161.03,37.07 0 top
C7  156.84,48.79 180 top
C8  156.82,47.12 180 top
C9  156.79,45.7 180 top
C10  130.89,32.99 90 top
C11  172.08,89.47 270 top
C12  147.12,20.06 90 top
C13  25.53,23.09 90 top
C14  42.59,20.42 180 top
C15  129.12,33.16 90 top
C16  42.6,14.4 180 top
C17  127.7,33.16 90 top
C18  91.77,56.66 90 top
C19  108.69,58.19 180 top
C20  148.62,20.06 270 top
C21  108.59,56.51 180 top
C22  91.99,49.79 90 top
C23  140.38,31.31 180 top
C24  50.08,17.22 0 top
C25  50.23,18.98 0 top
C26  145.97,65.68 180 top
C27  127.02,38.37 90 top
C28  127.11,43.91 270 top
C29  89.03,86.49 90 top
C30  63.4,86.94 270 top
C31  12.57,37.46 90 top
C32  10.72,37.41 90 top
C33  61.92,86.94 90 top
C34  121.31,43.91 90 top
C35  121.31,38.37 270 top
C38  42.6,19.05 180 top
C39  42.6,15.77 180 top
C40  118.2,38.12 90 top
C41  118.2,44.08 270 top
C42  160.95,35.29 0 top
C43  93.68,56.49 90 top
C54  145.68,20.06 90 top
D1  130.97,40.8 270 top
D2  114.84,37.53 90 top
D3  160.54,31.92 0 top
D4  114.84,44.67 90 top
D6  102.34,49.8 0 top
J1  173.08,23.05 90 top
J2  90.16,42.54 0 top
J3  173.25,51.33 90 top
J4  141.22,97.92 0 top
J5  45.64,7.91 0 top
J7  58.34,94.05 0 top
J10  89.28,94.07 0 top
K1  175.46,82.75 90 top
K4  175.56,68.33 90 top
L1  137.61,42.15 270 top
L4  150.34,42.39 180 top
L5  96.9,56.05 0 top
LED1  177.36,36.52 270 top
P2  33.34,81.64 0 top
P4  128.27,94.51 0 top
Q1  123.92,38.37 270 top
Q2  123.92,43.91 270 top
Q5  99.5,61.44 90 top
Q30  91.72,61.39 0 top
R1  133.49,34.67 90 top
R2  134.84,34.67 270 top
R3  175.87,36.46 270 top
R4  26.24,15.16 180 top
R5  57.22,87.09 90 top
R6  119.88,43.91 270 top
R7  119.88,38.37 90 top
R8  168.09,50.58 180 top
R9  168.14,52.32 180 top
R10  50.08,15.78 180 top
R11  104.73,61.26 90 top
R12  26.26,17.98 180 top
R13  168.08,49.18 0 top
R14  168.14,53.71 180 top
R15  157.36,35.1 0 top
R16  153.09,20.06 270 top
R17  142.86,20.06 270 top
R18  170.41,89.47 90 top
R19  26.24,16.59 180 top
R20  156.77,44.28 0 top
R21  156.74,42.86 180 top
R22  26.26,19.43 180 top
R23  150.12,20.06 270 top
R24  144.25,20.06 270 top
R25  96.87,49.79 270 top
R26  79.9,49.96 270 top
R27  116.61,38.37 270 top
R28  116.61,43.91 90 top
R29  108.84,52.48 0 top
R31  32.76,57.31 180 top
R32  83.3,49.95 90 top
R33  81.78,49.97 270 top
R34  84.61,49.9 90 top
R35  86.03,49.88 270 top
R36  93.36,49.76 90 top
R37  94.7,49.8 270 top
R38  87.63,49.84 270 top
R39  78.57,49.96 90 top
R40  26.31,92.8 0 top
R41  30.84,92.8 180 top
R42  30.84,91.04 180 top
R50  50.08,14.35 180 top
R58  103.13,61.26 270 top
R67  151.64,20.06 270 top
R71  145.97,67.17 0 top
R72  146,68.6 0 top
R172  95.69,61.44 270 top
SD1  147.43,15.18 270 top
U1  157.12,40.15 270 top
U2  26.01,42.82 90 top
U4  102.97,56.33 0 top
U5  138.36,36.44 270 top
U6  154.82,65.57 270 top
U8  160.08,24.84 180 top
U11  34.19,17.22 0 top
U$10  [7.0底框]  181.12,-0.19 0 bottom
U$15  [7.0板框]  -0.07,-0.1 0 top
U$30  [ELECROW-NEW]  71.17,72.2 0 top

### Tracks (layer width: path | path; a pad name or v marks a point on that pad's centre or on a via)
3V3  (via drill 0.35, 0.5, 0.8 pad 0.55)  (14 unrouted)
  Top 0.254: R36.2 93.36,50.94 | 90.62,50.52 C5.1 | R25.1 96.71,50.55 95.69,49.54 95.69,48.7 97.54,46.85 100.4,46.85 101.58,45.67 J2.P$44 | 84.56,50.71 R34.2 | R26.1 79.9,50.64 | R26.1 | 60.6,86.33 v60.66,86.26 | v34.2,86.25 34.04,86.09 34.04,83.6 | P2.5 | P4.5 128.96,95.6 128.5,95.14 128.5,87.22 | 57.37,86.18 R5.1 | 138.46,87.21 138.45,87.22 | J4.2 140.04,93.26 | 30.08,91.15 30.14,90.96 R42.2 | R41.2 30.08,86.84 v30.68,86.25
  Top 0.5: C32.2 10.72,38.48 9.27,39.93 U2.2 | 157.32,70.04 U6.16 155.73,70.01 155,69.28 155,67.18 154.02,66.2 U6.4 149.11,66.2 148.59,65.68 C26.1 | 93.36,50.94 94.23,51.81 95.61,51.81 R25.1 | C5.1 90.57,52.65 89.31,53.91 84.61,53.91 | C33.1 61.84,86.26 v60.66,86.26 59.24,87.69 59.24,94.12 59.33,94.21 | C33.1 C30.2 | R34.2 84.61,53.91 | R39.2 R26.1 83.09,53.91 84.61,53.91 | C33.1 57.37,86.18 | 140.04,93.26 140.04,87.22
  Top 0.8: 63.72,86.21 64.74,87.22 109.42,87.22 | 53.44,15.77 R10.1 | SD1.4 148.53,13.71 | 59.33,94.21 59.33,93.8 | J10.3 90.23,93.92 90.23,87.42 C2.1 | 109.48,87.22 128.5,87.22 138.45,87.22 | 25.5,22.22 R22.2 | R36.2 90.62,50.52 | R18.1 168.92,87.22 140.04,87.22 138.45,87.22 | R32.2 84.56,50.71 | R34.2 84.61,62.23 89.14,66.76 109.42,66.76 136.68,66.76 | 138.44,87.23 138.45,87.22 | 148.53,11.57 SD1.4 | SD1.4 | 162.05,17.87 162.22,18.04 173.48,18.04 175.83,20.39 175.83,35.65 R3.2
  Top 1: C32.2 15.09,38.3 17.69,35.7 17.69,28.3 23.77,22.22 25.5,22.22 v53.99,22.22 53.99,16.33 53.44,15.77 | 109.42,87.22 109.42,66.76 | 146.76,63.23 146.76,60.25 155.95,51.06 C7.2 156,48.74 R20.1 150.61,44.28 L4.2 145.8,44.55 144.25,43 R24.1 | 146.76,63.23 146.76,65.71 | 136.68,66.76 140.72,62.73 146.26,62.73 146.76,63.23 | R24.1 R17.1 141.51,20.83 133.51,12.83 82.76,12.83 v73.26,22.32 | R24.1 C54.2 C12.2 C20.1 R23.1 R67.1 R16.1 154.98,20.83 157.85,17.96 161.97,17.96 162.05,17.87 162.05,14.18 158.61,10.73 149.37,10.73 148.53,11.57
  Bottom 0.254: 35.63,86.25 v30.68,86.25
  Bottom 0.5: v60.66,86.26 58.14,86.26 58.14,86.25 35.63,86.25 v34.2,86.25
  Bottom 1: v73.26,22.32 54.2,22.32 54.09,22.22 v53.99,22.22
  pour Top (no thermals): 108.33,86.96 109.47,85.83 110.81,87.17 108.54,87.17
  pour Top (no thermals): 91.45,87.63 90.32,88.77 88.97,87.42 91.24,87.42
  pour Top (no thermals): 24.33,22.11 25.47,20.98 26.6,22.11
  pour Top (no thermals): 52.81,21.95 53.57,21.19 54.32,21.95
  pour Top (no thermals): 146.22,63.86 145.08,62.73 146.43,61.38 146.43,63.65
  pour Top (no thermals): 161.76,17.66 162.39,16.95 163.19,17.66
  pour Top (no thermals): 161.09,17.58 161.76,16.91 162.43,17.58
  pour Top (no thermals): 84.73,52.77 85.86,53.91 84.52,55.25 84.52,52.98
  pour Top (no thermals): 141.3,87.26 140.23,87.26 138.55,87.26
  pour Top (no thermals): 84.48,55.04 83.34,53.91 84.69,52.56 84.69,54.83
  pour Top (no thermals): 130.13,86.92 128.54,88.52 126.94,86.92
  pour Top (no thermals): 145.63,20.94 144.24,22.32 142.86,20.94
  pour Top (no thermals): 141.56,87.26 139.96,88.85 138.36,87.26
  pour Top (no thermals): 111.06,66.68 109.47,68.27 107.87,66.68
AVDD_10V  (via drill 0.35, 0.5)  (2 unrouted)
  Top 0.254: v122.9,40.71 v122.91,40.72 | 84.77,29.21 83.58,30.41 J2.P$8
  Top 0.5: C10.2 127.74,33.88 C17.2 v122.91,33.92 118.2,29.21 84.77,29.21 | Q1.1 v122.9,40.71
  Top 0.8: D1.2 130.97,33.91 R1.1
  Bottom 0.5: v122.91,40.72 v122.91,33.92
BAT+  (1 unrouted)
  Top 1: 159.42,22.04 U8.P$5 U8.P$7 U8.P$8 J1.P$1
D+
  Top 0.254: J3.A6 170.1,51.08 169.8,51.38 169.8,52.08 | J3.B6 169.8,52.08 | 169.8,52.08 169.14,52.08 R9.1
D-
  Top 0.254: R8.1 J3.B7 173.9,50.58 174.22,50.9 174.22,51.31 173.94,51.58 J3.A7
DCLK1
  Top 0.254: J2.P$14 86.58,47.88 87.7,49.01 R38.2 C1.2
ESP32_RESET  (via drill 0.35, 0.35 pad 0.55)  (2 unrouted)
  Top 0.254: 175.54,72.34 K4.2 | U2.3 10.54,53.18 v12.36,55 | J2.P$7 83.08,46.36 v82.42,47.02 | 175.85,72.62 175.85,73.06 178.21,75.41 178.21,88.33 176.3,90.23 R18.2 161.2,99.44 29.99,99.44 24.07,93.52 | 24.07,93.52 11.84,81.29 11.84,78.68 | 11.84,78.69 v11.84,67.59 | R40.1 24.8,92.8 24.07,93.52
  Top 0.3: 175.85,72.62 K4.2
  Bottom 0.254: v82.42,47.02 71.33,58.11 24.13,58.11 21.02,55 v12.36,55 11.86,55.5 11.86,67.57 v11.84,67.59
GND  (via drill 0.35, 3.2 pad 5.2)
  Top 1: v8.99,64 8,63.01 U2.40 8,57.91 8.31,57.61 | 8.1,45.59 8,45.49 U2.1 8,27.66 8.38,27.28 | J3.P$7 J3.P$9 | J3.P$6 J3.P$8 | K1.1 172.09,82.75
  other vias: 177.6,100.46 3.6,100.46 3.6,3.47 177.6,3.48 22.75,76.03 111.93,85.2 146.39,32.86 69.49,27.63 13.31,32.59 171.85,42.64 25.84,91.59 95.78,5.31 61.25,16.24 100.49,58.62 109.27,100.95 15.26,77.33 117.33,47.97 169.86,28.52 67.45,91.12 170.65,54.43 119.04,34.62 15.22,35.49 150.96,100.9 95.58,91.1 9.33,77.09 153.19,46.85 160.54,29.51 9.99,3.36 16.11,11.91 107.97,33.33 36.44,71.24 39.7,9.44 101.94,62.4 170.53,57.14 111.03,56.17 160.68,3.36 117.44,25.67 145.12,100.87 159.36,46.7 67.17,70.13 15.23,19.82 171.31,55.95 159.18,43.43 27.97,83.56 107.93,96.97 122.63,47.94 98.58,101.46 159.16,15.09 28.6,99.94 159.11,77.06 105.65,70.2 76.35,94.64 65.94,8.51 146,17.61 168.37,8.33 137.55,97.72 106.71,79.59 136.84,24.7 58.91,9.42 135.04,5.26 93.69,54.01 166.57,55.53 77.57,78.68 133.71,37.25 165.5,16.18 120.76,47.93 164.78,55.11 110.74,30.59 88.22,100.95 167.41,36.65 125.5,88.78 57.73,101.01 74.88,91.07 136.93,20.21 165.92,3.33 131.36,78.24 8.49,29.07 87.75,70.32 104.71,41.5 148.53,17.82 164.28,29 9.02,66.41 39.77,13.89 15.22,34.31 90.54,56.63 171.78,39.14 160.94,65.18 171.99,57.37 150.64,27.44 158.92,16.48 76.93,84.02 113.72,34.38 63.51,33.21 163.52,48.96 137.71,34.02 121.52,34.54 120.23,96.37 154.09,32.2 24.55,96.36 7.89,40.83 17.56,40.78 13.89,40.81 161.02,70.59 25.7,30.7 20.61,92.83 63.91,78.58 48.43,25.78 74.53,101.13 54.87,61.42 115.2,5.27 119.01,48.03 154.42,29.71 34.36,13.16 8.83,45.55 8.83,48.65 8.88,51.83 8.83,55.43 8.91,58.25 100.93,56.35 102.46,53.63 104.64,53.71 109.47,61.94 64.42,83.76 68.95,101.06 167.43,70.59 101.48,52.49 99.69,56.35 25.61,38.09 16.59,3.25 15.4,80.65 8.73,19.24 10.85,56.65 8.53,24.01 28.35,21.11 9.01,68.73 172.13,30.92 8.98,71.08 172.27,25.73 9.05,73.94 23.43,3.58 8.65,33.98 153.19,24.35 39.58,20.85 148.79,53.46 32.49,21.11 150.03,49.64 167.11,19.83 172.24,27.92 47.7,14.08 155.18,23.69 47.59,17.16 146.47,37.28 47.74,15.42 52.48,19.87 50.57,20.7 146.28,7.84 164.81,9.63 159.29,44.99 154.3,16.4 159.36,47.92 154.58,12.81 150.46,12.91 96.11,84.42 48.29,96.82 156.59,73.53 152.8,89.81 152.64,73.54 111.04,57.71 112.47,79.21 168.48,56.19 17.14,89.73 170.12,69.69 171.59,81.88 171.63,74.4 170.24,59.51 168.42,58.23 85.52,84.28 70.87,83.61 44.02,101.52 21.6,58.35 55.08,40.77 113.11,22.32 9.07,11.53 153.53,42.39 159.65,41.71 128,11.2 90.84,64.42 126.48,11.16 104.37,30.35 116.6,30.66 138.25,62.19 109.82,11.29 154.38,41.31 58.95,20.62 147.68,24.26 9.6,80.31 15.28,70.86 133.7,51.85 154.5,55.89 172.24,45.25 169.07,45.23 170.73,45.21 167.04,42.66 171.77,46.8 171.61,16.28 97.26,11.04 49.75,70.48 26,88.57 50.07,83.4 88.36,62.41 168.88,75.05 19.32,57.84 28.12,61.75 47.54,61.37 39.8,61.41 22.76,54.73 23.94,55.99 7.92,38.54 49.76,33.59 45.22,40.14 101.08,32.64 11.62,47.09 27.83,60.11 16.83,24.04 18.3,38.66 78.22,56.97 83.11,52.13 105.35,84.77 39.98,97.15 52.79,27.32 59.38,37.99 46.22,31.35 25.74,28.02 12.79,86.28 9.43,100.56 11.45,93.5 16.99,98.79 52.12,79.24 29.61,70 44.64,83.19 29.69,94.7 22.8,88.4 112.87,69.7 120.85,85.41 125.05,83.47 135.55,80.62 148.53,77.22 137.78,77.9 137.27,83.69 148.44,83.36 159.2,83.52 167.6,85.37 140.01,69.61 115.14,91.03 107.11,90.96 111.84,96.88 157.44,100.96 169.43,101.57 136.25,89.81 146.42,88.88 156.92,93.42 160.45,89.97 164.31,88.8 132.53,59.79 117.91,60.12 112.29,37.27 117.83,55.08 132.82,89.99 128.25,48.45 135.3,55.92 59.87,24.59 150,70.62 147.73,70.62 148.91,69.7 135.55,74.4 141.35,64.83 171.84,66.17 167.05,63.23 163.81,93.42 146.84,97.28 163.38,44.69 164.56,39.84 145.08,52.58 148.52,63.75 167.5,25.73 167.33,31.21 169.86,34.03 170.25,25.68 133.78,38.54 152.18,27.37 136.89,29.55 161.26,40.97 150.51,36.18 154.62,42.82 159.45,49.42 115.44,47.91 104.25,52.49 88.88,46.27 90.9,46.19 93,46.19 93.84,19.73 122.48,31.23 63.05,61.46 109.81,45.21 62.68,4.39 38.19,3.64 109.44,60.81 98.86,62.91 109.11,49.73 106.84,49.05 105.24,45.53 85.92,52.25 97.35,62.75 90.63,54.35 79.66,52.13 117.2,19.84 87.37,19.96 58.47,18.03 148.53,47.79 142.99,48.8 143.82,57.01 126.77,54.99 101.15,20.38 78.37,4.73 81.76,54.99 71.68,61.37 25.62,35.4 25.7,40.52 19.53,72.44 19.11,69.16 43.05,78.99 44.56,91.09 83.78,47.26 84.12,46.08 22.66,62.84 117.24,41.22 120.6,41.14 125.05,41.22 135.13,37.27 124.83,35.35 136.52,34.13 132.57,31.44 128.96,31.02 126.27,31.11 128.37,35.98
  pour Top (rank 3): 0.02,104.06 181.12,104.06 181.12,-0.02 0.02,-0.02 0.02,41.98 7.49,41.98 7.49,61.64 0.02,61.64
  pour Bottom: 7.91,102.21 173.14,102.21 173.14,1.83 7.91,1.83
I2S_BCLK
  Top 0.3: U11.3 R19.1
I2S_CTRL
  Top 0.3: U11.1 27.33,19.13 R22.1
I2S_SDIN
  Top 0.3: U11.4 27.15,15.32 R4.1
IO0_BOOT_CLK  (via drill 0.35)
  Top 0.254: v42.52,81.12 24.51,63.11 U2.27 25.58,60.82 28.16,63.4 v30.09,63.4 | v140.04,81.29 140.21,81.29 143.15,84.23 172.97,84.23 175.46,86.72 K1.2 | v87.12,52.4 87.63,51.89 R38.1
  Bottom 0.254: v42.52,81.12 42.72,81.33 140.04,81.33 v140.04,81.29 | v30.09,63.4 30.17,63.48 76.04,63.48 v87.12,52.4
IO1_G7  (via drill 0.35)
  Top 0.254: v20.14,47.33 20.14,49.54 9.27,60.41 U2.39 | J2.P$31 95.08,37.82 94.3,37.04 94.3,34.93 v94.27,34.89
  Bottom 0.254: v94.27,34.89 94.18,34.97 80.63,34.97 68.27,47.33 v20.14,47.33
IO2_LCD_BL_CTR  (via drill 0.35)
  Top 0.254: v14.68,66.62 10.54,62.49 U2.38 | U4.4 105.04,57.63 106.28,58.87 106.28,61.3 105.55,62.02 R11.2 104.73,63.28 104.71,63.26 v104.71,63.19
  Bottom 0.254: v14.68,66.62 14.85,66.62 15.36,67.14 100.76,67.14 v104.71,63.19
IO3_G4  (via drill 0.35)
  Top 0.254: v90.99,32.91 90.99,36.25 93.58,38.84 J2.P$28
  Top 0.3: v27.64,45.07 v27.64,45.08 26.26,45.08 U2.15
  Bottom 0.3: v90.99,32.91 90.82,32.74 79.04,32.74 66.95,44.82 27.89,44.82 v27.64,45.07
IO4_B7  (via drill 0.35)
  Top 0.254: v96.17,35.69 96.17,36.19 99.08,39.11 J2.P$39
  Top 0.3: U2.4 11.89,42.9 11.89,44.71 14.34,47.17 v17.62,47.17
  Bottom 0.3: v17.62,47.17 18.71,47.17 20.74,49.2 67.96,49.2 81.47,35.69 v96.17,35.69
IO5_B6  (via drill 0.35)
  Top 0.254: J2.P$38 98.58,40.06 v98.3,39.78
  Top 0.3: U2.5 13.16,42.9 v13.16,44.21
  Bottom 0.3: v13.16,44.21 13.16,49.51 16.97,53.31 69.33,53.31 84.16,38.48 91.1,38.48 92.41,39.78 v98.3,39.78
IO6_B5  (via drill 0.35)
  Top 0.254: v97.59,38.98 97.59,42.35 98.08,42.84 J2.P$37
  Top 0.3: U2.6 14.43,42.9 14.43,44.17 v14.39,44.21
  Bottom 0.3: v14.39,44.21 14.3,44.29 14.3,49.67 17.13,52.5 69.07,52.5 83.64,37.92 91.54,37.92 92.59,38.98 v97.59,38.98
IO7_B4  (via drill 0.35)
  Top 0.254: v96.91,38.2 96.87,38.23 96.87,42.29 97.58,42.99 J2.P$36
  Top 0.3: v15.65,44.38 15.53,44.26 15.53,42.92 U2.7
  Bottom 0.3: v96.91,38.2 92.73,38.2 91.88,37.35 83.03,37.35 68.74,51.64 17.53,51.64 15.65,49.76 v15.65,44.38
IO8_G5  (via drill 0.35)
  Top 0.254: v21.95,44.23 21.97,44.21 U2.12 | v91.76,32.19 91.78,32.21 91.78,36.25 94.08,38.55 J2.P$29
  Bottom 0.3: v91.76,32.19 91.67,32.11 78.56,32.11 66.44,44.23 v21.95,44.23
IO9_G2  (via drill 0.35)
  Top 0.254: v89.18,34.26 89.18,36.44 92.58,39.84 J2.P$26
  Top 0.3: U2.17 28.21,47.37 v28.98,46.61
  Bottom 0.3: v89.18,34.26 89.09,34.34 80.14,34.34 68.13,46.35 28.98,46.35 v28.98,46.61
IO10_TF_CS  (via drill 0.35)
  Top 0.3: v85.86,6.76 85.46,7.16 79.6,7.16 38.12,48.64 U2.18 | SD1.2 150.6,15.31 150.6,16.52 151.52,17.44 v151.52,17.52 151.52,19.17 R67.2
  Bottom 0.254: v85.86,6.76 85.88,6.77 140.77,6.77 v151.52,17.52
IO11_TF_SPI_MOSI/TP_DIN  (via drill 0.35)  (1 unrouted)
  Top 0.254: 82.99,7.89 82.91,7.89 v82.87,7.92
  Top 0.3: R23.2 150.12,17.99 v150.15,17.96 149.82,17.62 149.82,14.73 | U2.19 38.99,49.91 80.98,7.92 v82.87,7.92
  Bottom 0.254: v82.87,7.92 140.11,7.92 v150.15,17.96
  Bottom 0.3: v82.87,7.92 82.9,7.92
IO12_TF_CLK/TP_CLK  (via drill 0.35)
  Top 0.3: U2.20 39.08,51.18 81.56,8.7 v81.91,8.7 | v147.43,16.61 SD1.5
  Bottom 0.254: v81.91,8.7 139.52,8.7 v147.43,16.61
IO13_TF_SPI_MISO/TP_OUT  (via drill 0.35)
  Top 0.3: R24.2 144.25,17.41 v144.41,17.41 144.41,17.26 145.23,16.44 SD1.7 | v81.28,10.16 38.99,52.45 U2.21
  Bottom 0.254: v81.28,10.16 137.17,10.16 v144.41,17.4 v144.41,17.41
IO14_R3  (via drill 0.35)
  Top 0.254: J2.P$19 89.08,43.35 87.86,42.13 v87.86,39.22
  Top 0.3: U2.22 26.29,53.44 28.39,53.44 v29.1,54.16
  Bottom 0.3: v87.86,39.22 87.82,39.26 84.41,39.26 69.52,54.16 v29.1,54.16
IO15_B3  (via drill 0.35)
  Top 0.254: v96.19,37.34 v96.18,37.35 96.18,42.24 97.08,43.14 J2.P$35
  Top 0.3: v16.73,44.53 16.82,44.43 16.82,42.89 U2.8
  Bottom 0.3: v96.19,37.34 92.85,37.34 92.33,36.82 82.5,36.82 68.57,50.75 18.57,50.75 16.73,48.9 v16.73,44.53
IO16_G6  (via drill 0.35)
  Top 0.254: v93.36,36.43 93.36,37.18 94.54,38.36 94.54,44.23 J2.P$30
  Top 0.3: U2.9 18.49,43.15 18.49,48.91 v18.36,49.04
  Bottom 0.3: v93.36,36.43 93.36,36.26 81.93,36.26 68.17,50.02 19.34,50.02 v18.36,49.04
IO17_I2S_SDIN  (via drill 0.35)
  Top 0.254: U2.10 19.43,40.76 21.29,38.9 v21.27,38.87 | v22.78,15.1 22.84,15.16 R4.2
  Bottom 0.254: v21.27,38.87 21.27,16.61 v22.78,15.1
IO18_I2S_LRCLK  (via drill 0.35)
  Top 0.254: U2.11 20.71,42.81 20.71,40.72 21.79,39.64 v22.37,39.64
  Top 0.3: R12.2 23.72,17.98 22.4,19.3 v22.4,20.9
  Bottom 0.3: v22.37,39.64 22.4,39.64 v22.4,20.9
IO19_I2C_SDA  (via drill 0.35)
  Top 0.254: v16.14,57.1 23.1,50.14 23.1,42.96 U2.13 | v18.35,65.44 18.35,65.37 26.73,73.75 28.83,73.75 32.53,77.45 P2.2 32.53,88.02 v34.46,89.94 34.46,90.79 32.44,92.81 R41.1 | P4.2 127.46,90.2 v127.45,90.19
  Bottom 0.254: v16.14,57.1 16.14,64.83 16.75,65.44 v18.35,65.44 | v127.45,90.19 127.25,89.99 34.5,89.99 v34.46,89.94
IO20_I2C_SCL  (via drill 0.35)
  Top 0.254: v17.08,64 17.08,65.42 26.1,74.45 28.67,74.45 32.03,77.8 32.03,83.14 | v17.09,57.85 17.09,56.82 24.51,49.4 U2.14 | 32.03,83.14 P2.1 32.03,88.61 33.03,89.61 v33.03,91.04 R42.1 31.52,91.04 | v125.43,92.13 126.18,92.13 126.96,92.9 P4.1 | 32.02,83.13 32.03,83.14
  Bottom 0.254: v17.08,64 17.09,63.98 v17.09,57.85 | v33.03,91.04 34.15,92.16 125.4,92.16 v125.43,92.13
IO21_R4  (via drill 0.35)
  Top 0.254: J2.P$20 89.58,43.17 88.55,42.15 88.55,40.01 v88.57,39.99
  Top 0.3: U2.23 27.47,54.99 v27.75,54.71
  Bottom 0.3: v88.57,39.99 84.62,39.99 69.65,54.96 27.99,54.96 v27.75,54.71
IO38_D  (1 unrouted)
  Top 0.254: 55.29,94.73 55.29,93.64 55.29,89.78 | 127.96,98.43 99.14,98.43 97.71,97 56.3,97 55.29,95.99 55.29,94.73 | U2.31 19.43,61.98 33.03,75.58 P2.3 33.03,87.43 40.34,94.73 55.29,94.73 | R5.2 55.34,89.73 J7.1 | P4.3 127.96,98.43 | 145.08,92.46 145.08,96 142.65,98.43 127.96,98.43
  Top 0.3: J7.1 55.29,93.9 55.29,93.64
IO39_HSYNC  (via drill 0.35)
  Top 0.254: v20.07,63.67 18.08,61.68 18.08,60.91 U2.32 | J2.P$40 99.58,43.13 100.05,42.67 v100.05,41.57
  Bottom 0.254: v100.05,41.57 98.95,41.57 76.35,64.17 20.57,64.17 v20.07,63.67
IO40_VSYNC  (via drill 0.35)
  Top 0.254: J2.P$41 100.08,45.36 99.66,45.78 96.27,45.78 v95.84,46.22 | v20.01,64.75 20.01,64.62 16.89,61.5 U2.33
  Bottom 0.254: v95.84,46.22 77.22,64.84 20.1,64.84 v20.01,64.75
IO41_DE  (via drill 0.35)
  Top 0.254: J2.P$42 100.58,42.76 100.83,42.51 v100.83,42.42 | U2.34 15.62,61.38 19.81,65.57 v21.24,65.57
  Bottom 0.254: v100.83,42.42 100.75,42.42 76.59,66.58 22.25,66.58 v21.24,65.57
IO42-I2S_BCLK  (via drill 0.35)
  Top 0.254: v21.14,46.37 21.14,49.75 14.01,56.88 14.01,60.49 U2.35 | R19.2 20.05,16.59 v20.04,16.6
  Bottom 0.3: v20.04,16.6 20.04,43.1 21.14,44.19 v21.14,46.37
IO45_R7  (via drill 0.35)
  Top 0.254: v29.21,57.34 29.24,57.31 R31.2 | v91.09,42.3 J2.P$23
  Top 0.3: U2.26 27.73,58.82 v29.21,57.34
  Bottom 0.3: v91.09,42.3 85.79,42.3 70.75,57.34 v29.21,57.34
IO46_G3  (via drill 0.35)
  Top 0.254: v90.22,33.52 90.22,36.38 93.08,39.23 J2.P$27
  Top 0.3: U2.16 26.75,46.1 26.84,46.2 v27.85,46.2
  Bottom 0.3: v27.85,46.2 28.52,45.53 67.63,45.53 79.64,33.52 v90.22,33.52
IO47_R5  (via drill 0.35)
  Top 0.254: v89.56,40.74 89.59,40.76 89.59,42.53 90.08,43.02 J2.P$21
  Top 0.3: U2.24 27.78,56.26 v27.78,56.01
  Bottom 0.254: v89.56,40.74 84.87,40.74 69.85,55.76
  Bottom 0.3: v27.78,56.01 28.03,55.76 69.85,55.76
IO48_R6  (via drill 0.35)
  Top 0.254: v90.4,41.51 90.38,41.53 90.38,42.59 90.58,42.79 J2.P$22
  Top 0.3: U2.25 27.63,57.53 v27.82,57.34
  Bottom 0.3: v90.4,41.51 85.13,41.51 70.11,56.53 28.71,56.53 27.91,57.34 v27.82,57.34
L/R
  Top 0.254: J2.P$12 85.58,48.17 R34.1 86.01,49.14 R35.2
LCD_LEDA  (2 unrouted)
  Top 0.5: U4.5 103,57.6 103,56.92 103.67,56.26 104.8,56.26 106.73,58.19 C19.2 107.83,58.16 C21.2 | D6.2 104.63,50.01 | 105.68,50.23 105.68,54.66 107.44,56.43 107.74,56.43 C21.2 | C21.2 110.81,53.52 110.81,49.71 105.37,44.27 J2.P$50 104.16,44.27
LCD_LEDK  (via drill 0.35)  (2 unrouted)
  Top 0.5: v104.89,55.02 104.88,55.03 U4.3 | v108.03,53.63 108.08,53.58 R29.1 108.08,48.71 105.8,46.43 103.92,46.43 103.33,45.84 103.33,43.72
  Bottom 0.5: v108.03,53.63 | v108.03,53.63 106.64,55.02 v104.89,55.02
LRCLK
  Top 0.3: U11.2 27.15,17.86 R12.1
N$1
  Top 0.3: R3.1 175.87,37.28 LED1.+
N$2
  Top 0.254: J2.P$45 102.08,46.18 100.78,47.48 98.42,47.48 R25.2
N$3
  Top 0.5: C14.1 43.37,20.4 C38.1 45,19.05 46.64,17.41 J5.P$2
N$4
  Top 0.254: R26.2 79.9,48.53 82.08,46.35 J2.P$5
N$5
  cutout Top: 100.31,45.09 99.3,45.09 99.3,46.18 100.31,46.18
  cutout Top: 97.2,50.97 97.2,45.09 96.78,45.09 96.78,50.97
  cutout Top: 151.38,18.46 150.38,18.46 150.38,19.55 151.38,19.55
  cutout Top: 152.9,18.54 151.89,18.54 151.89,19.64 152.9,19.64
  cutout Top: 144.16,18.46 143.15,18.46 143.15,19.55 144.16,19.55
N$6
  Top 0.5: U11.8 41.77,19.13 C38.2
N$7
  Top 0.5: U5.3 137.11,35.43 R1.2
  Top 1: R2.1 R1.2
N$8
  Top 0.5: U11.5 41.39,15.32 C39.2
N$9  (1 unrouted)
  Top 0.8: C28.2 127.11,39.21 C27.2
  Top 1: L1.2 134.53,43.07 127.19,43.07
  pour Top (rank 2): 136.6,45 129.88,45 129.29,44.42 129.29,42.06 129.71,41.64 132.06,41.64 136.6,37.11 137.61,37.11 137.61,44
N$10
  Top 1: C27.1 125.69,37.61 Q1.3
N$11
  Top 0.3: J3.A5 169.75,50.08 R13.2
N$12  (1 unrouted)
  Top 0.254: R37.2 94.7,48.62 96.97,46.35 99.98,46.35 101.07,45.26 J2.P$43 | R36.1 95,49
N$13
  Top 0.8: U1.3 155.9,39.22 151.35,39.22 L4.1
N$14
  Top 0.254: R39.1 78.57,48.44 81.58,45.43 J2.P$4
N$15
  Top 0.5: C39.1 C16.1 44.64,13.12 J5.P$1
N$16  (1 unrouted)
  Top 0.8: L5.2 97.29,55.03 U4.1 99.32,52.32 99.32,50.39
N$17
  Top 0.3: J3.B5 169.53,53.08 R14.1
N$20
  Top 0.5: R20.2 157.53,42.88 | 157.53,42.88 R21.1 | U1.5 157.53,41.89 157.53,42.88
N$23  (1 unrouted)
  Top 0.8: Q5.1 104.73,60.49 R11.1
N$24
  Top 1: C28.1 125.69,44.67 Q2.3
N$29  (2 unrouted)
  Top 0.8: Q1.2 122.73,37.59 119.9,37.59
N$30  (2 unrouted)
  Top 0.8: 122.73,44.69 119.9,44.69
  Top 1: Q2.1 122.73,44.69
N$36
  Top 0.8: Q30.1 92.96,60.42 95.43,60.42 R172.2 97.63,60.68 Q5.3
N$40
  Top 0.3: U6.2 152.2,68.59 R72.2
N$42
  Top 0.3: R71.2 146.98,67.41 152.29,67.41 U6.3
N$47
  Top 0.3: SD1.1 151.8,15.21 151.8,15.43 153.09,16.72 R16.2
N$48
  Top 0.3: SD1.8 144.13,16.49 142.86,17.76 R17.2
RESET  (via drill 0.35)
  Top 0.254: v129.46,92.92 P4.6 | v34.54,80.2 34.53,80.21 P2.6 | v28.41,92.82 28.41,92.8 R40.2 27.07,81.71 v28.63,80.15
  Bottom 0.254: v34.54,80.2 34.49,80.15 v28.63,80.15
  Bottom 0.3: v129.46,92.92 129.44,92.9 28.49,92.9 v28.41,92.82
U/D
  Top 0.254: J2.P$11 85.08,47.41 R32.1 83.32,49.21 R33.2
UART0_RXD0  (via drill 0.35)
  Top 0.254: U2.36 13.08,62.5 18.06,67.48 v18.06,76.14 | R72.1 127.97,85.87 v124.8,85.87 | J10.1 v86.28,88.22
  Bottom 0.254: v18.06,76.14 30.14,88.22 v86.28,88.22 122.45,88.22 v124.8,85.87
UART0_TXD0  (via drill 0.35)
  Top 0.254: U2.37 11.81,62.33 16.84,67.35 v16.84,76.2 | R71.1 144.96,67.17 128.16,83.96 v128.06,83.96 | J10.2 88.28,89.02 v88.3,89
  Bottom 0.254: v16.84,76.2 16.84,76.7 29.14,89 v88.3,89 123.02,89 v128.06,83.96
USB_D+
  Top 0.254: U6.5 153.55,64.93 155.08,63.4 155.08,60.29 163.3,52.07 167.12,52.07 R9.2
USB_D-
  Top 0.254: U6.6 153.56,63.66 154.24,62.98 154.24,59.79 163.11,50.92 166.99,50.92 R8.2
VBUS  (5 unrouted)
  Top 0.3: U8.P$4 158.18,28.1 158.17,28.1 | R15.2 158.09,35.12
  Top 0.6: 173.9,53.74 172.86,53.74 | 170.74,48.93 173.81,48.93
  Top 0.65: 173.9,53.74 175.54,52.09 175.54,50.66 173.81,48.93
  Top 0.8: 165.76,43.73 165.65,43.84
  Top 1: 165.65,43.84 170.74,48.93 | 165.76,43.73 165.76,26.37 163.63,24.24 159.07,24.24 157.87,25.44 157.87,31.75 D3.1 158.12,32 R15.2
VDD  (via drill 0.35)  (4 unrouted)
  Top 0.3: U11.6 37.8,16.59
  Top 0.5: U11.6 38.68,16.59 39.31,17.21 v39.51,17.21 | v47.36,18.98 49.17,18.98
  Top 0.8: R50.2 49.32,18.82
  Bottom 0.5: v39.51,17.21 45.6,17.21 v47.36,18.98
VGH+18V  (2 unrouted)
  Top 0.254: 84.6,44.29 J2.P$10 84.58,32.49 87.01,30.05 87.54,30.05
  Top 0.5: D2.- 114.82,39.21 111.82,39.21 102.66,30.05 87.54,30.05 87.12,30.05
  Top 0.8: R7.2 114.89,39.13
  Top 1: 114.89,39.13 D2.-
VGL-8.2V  (via drill 0.35 pad 0.55, 0.5)  (2 unrouted)
  Top 0.254: v85.11,30.39 85.11,30.47 84.08,31.5 J2.P$9
  Top 0.5: D4.+ 110.67,43.02 v109.97,42.32
  Top 0.8: R6.2 114.98,43.15
  Top 1: 114.98,43.15 D4.+
  Bottom 0.5: v109.97,42.32 109.87,42.21 107.41,42.21 95.59,30.39 v85.11,30.39
VIN  (via drill 0.8, 0.8 pad 0.55)  (5 unrouted)
  Top 0.3: 161.88,36.99 161.88,35.19
  Top 0.5: U1.1 156.42,41.1 U1.4
  Top 0.8: R172.1 95.5,62.39 95.38,62.39 93.02,62.39 | U8.P$1 U8.P$3 | v56.63,14.26 50.94,14.26 R50.1
  Top 1: U8.P$1 162.41,28.06 162.41,31.28 D3.2 161.88,33.08 161.88,35.19 161.88,37.71 160.43,39.16 158.69,39.16 | 159,39.2 U1.4 158.32,38.27 157.06,37.01 154.38,37.01 151.39,34.03 151.39,31.3 148.37,28.28 v147.7,28.28 | 139.56,41.95 U5.5 U5.4 139.53,35.46 C3.2 v139.53,28.29 v139.54,28.29 | 139.56,41.95 L1.1 | 139.56,41.95 139.56,57.5 132.06,65 97.99,65 95.38,62.39 | Q30.2 93.02,62.39
  Bottom 1: 147.66,28.24 v147.7,28.28 v147.69,28.29 v139.54,28.29 139.54,17.79 134.75,13 57.89,13 v56.63,14.26
VIN2  (1 unrouted)
  Top 0.8: U4.6 97.08,57.63 L5.1 96.87,57.42 C18.2 90.52,58.68 Q30.3
(copper drawn outside any net)
  shapes: Top area x2

### Text on the board
tPlace: www.elecrow.com | V1.1
tNames: J4 | IO38 | NC | 3V3 | GND | IO44-RX0 | IO43-TX0 | 3V3 | GND | GND | 3V3 | NC | IO38 | 6 | 1 | 6 | 1 | GND | 5V | 50 | 1 | - | + | I2S-CTRL | IO18-I2S-LRCLK | IO42-I2S-BCLK | VON- | VOP+ | IO17-I2S-SDIN
tStop: Wizee-ESP32 | WZ8048C070